# EAGLE design schody.v1 (EAGLE 8.7.0)
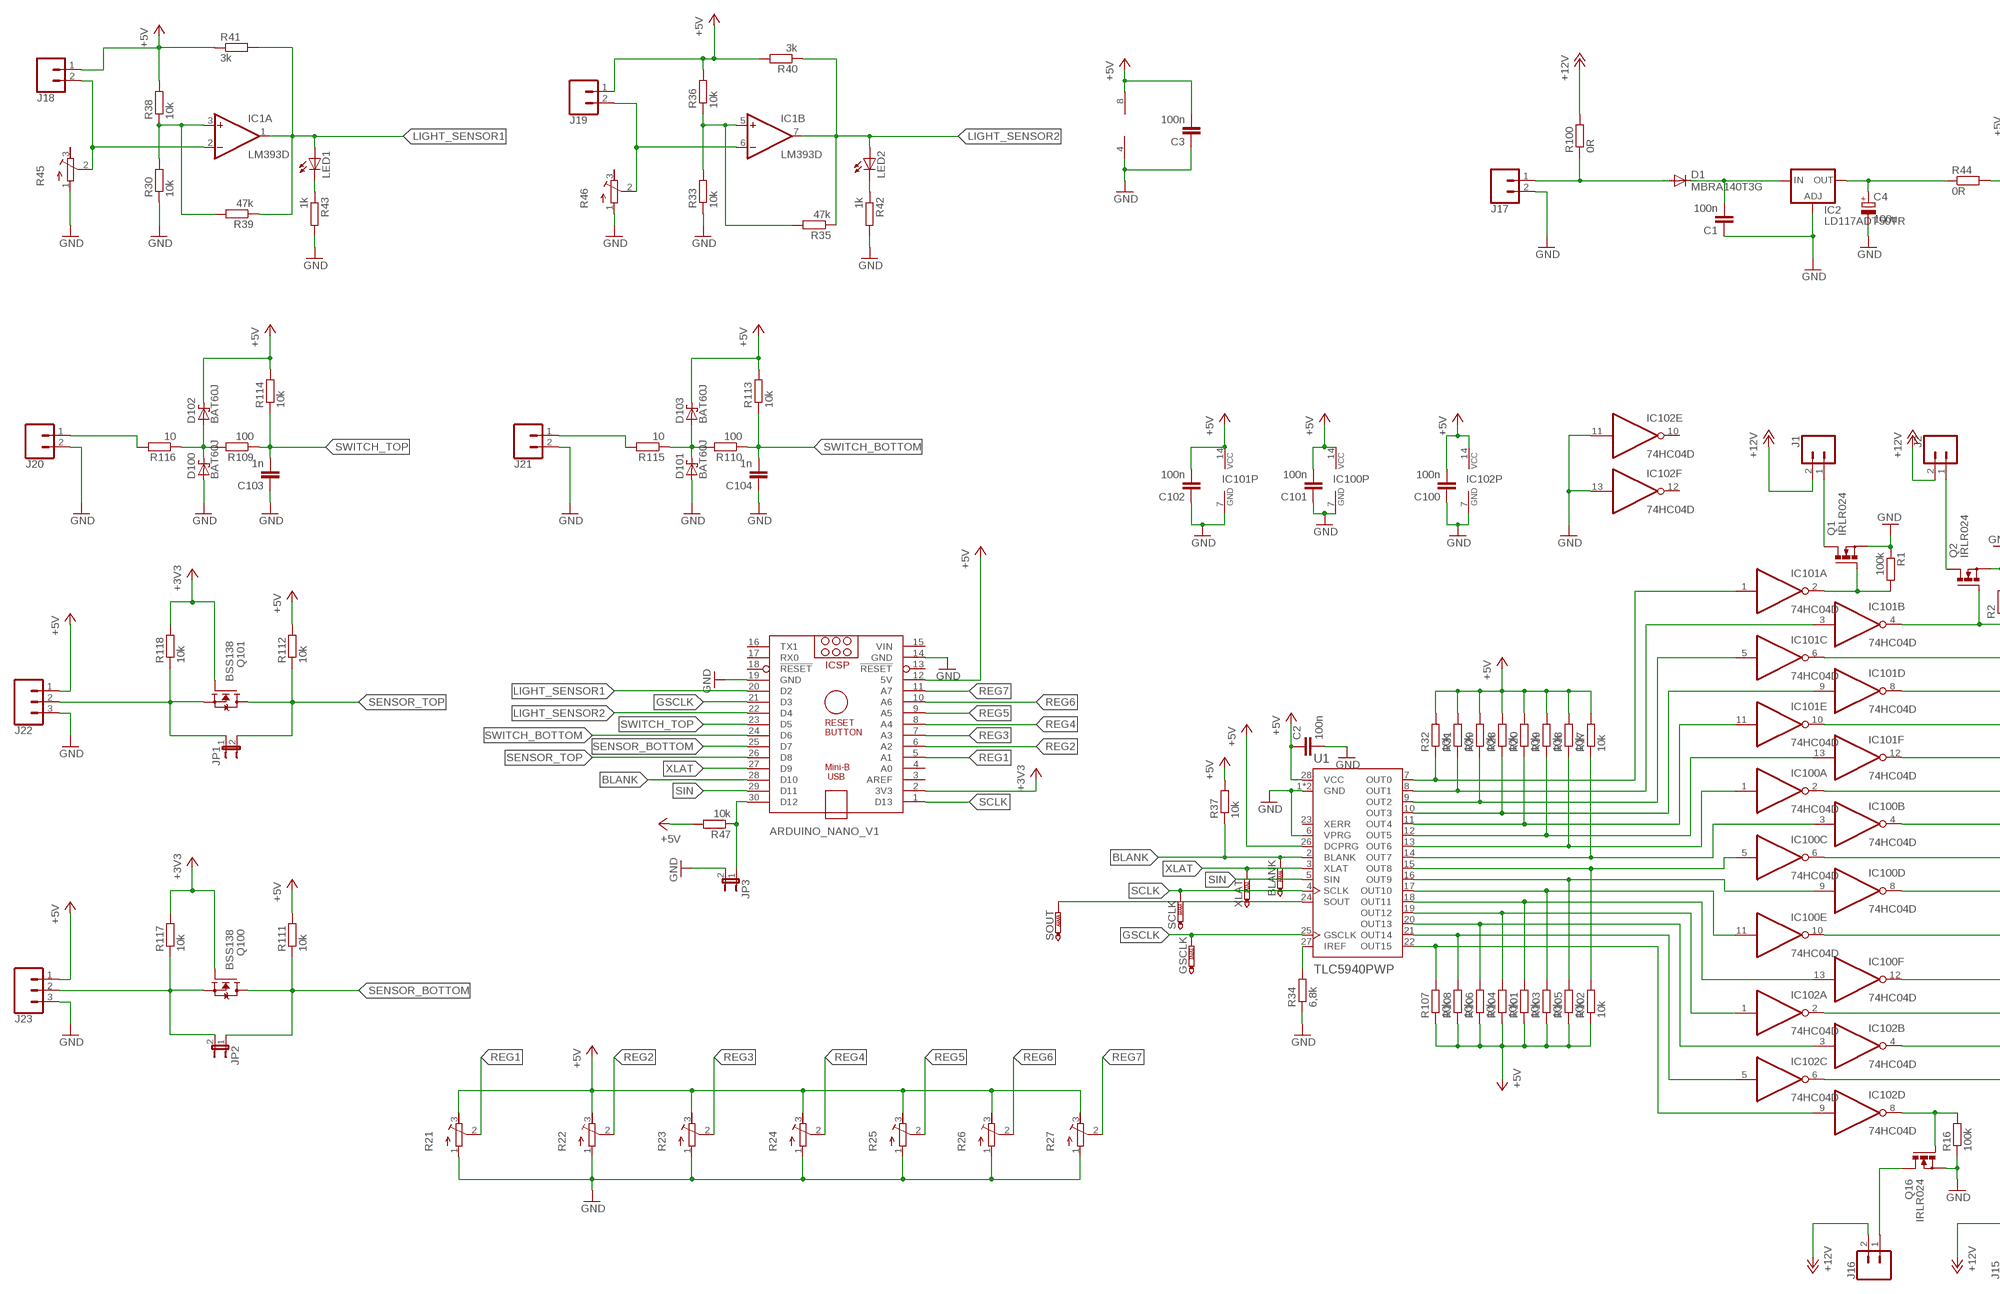
[diagram p0: schematic, sheet 1, part 1 of 2]
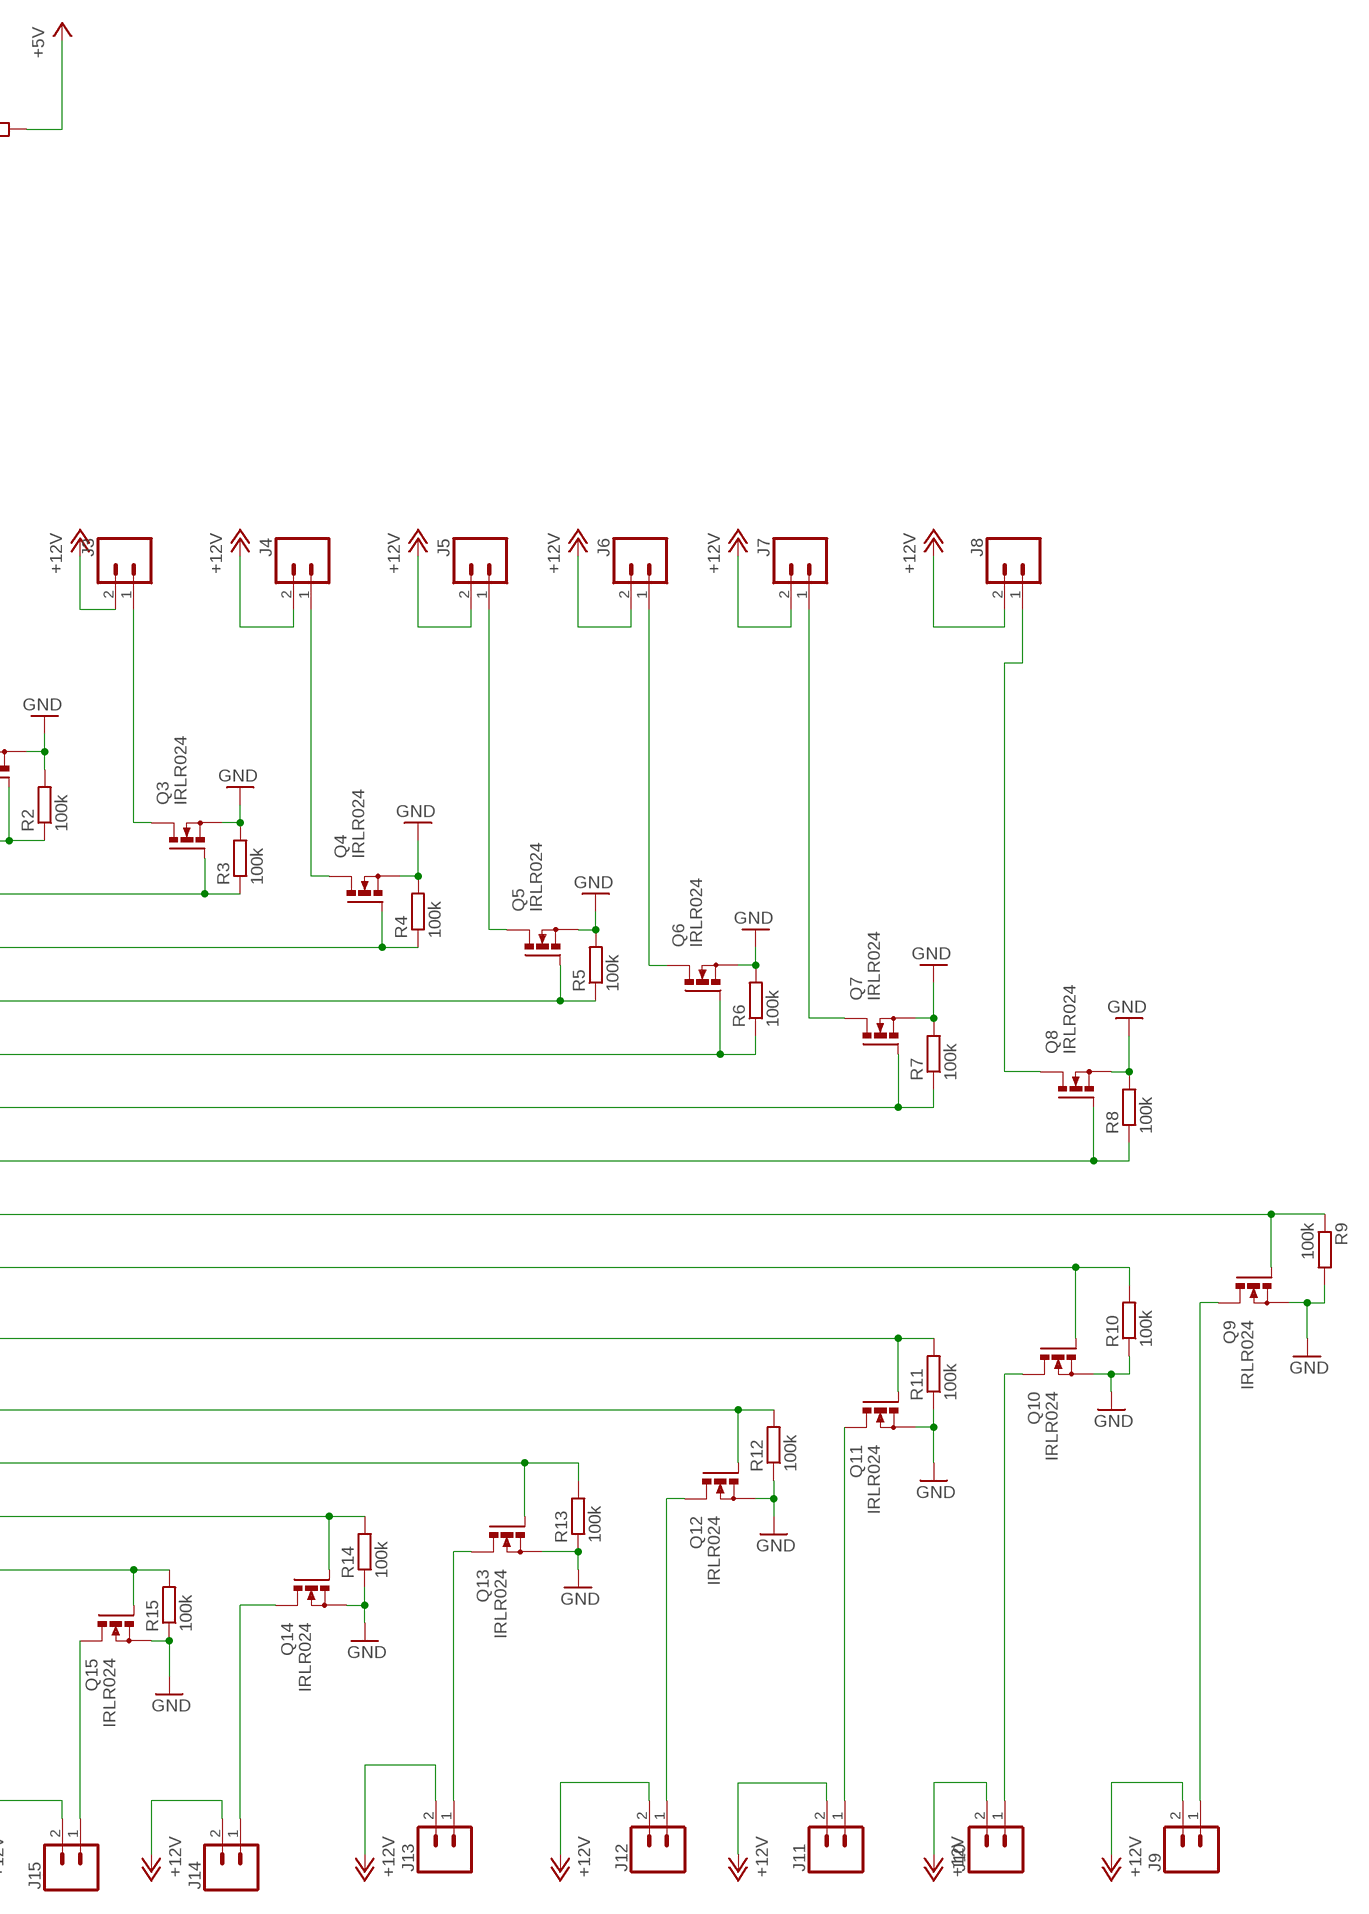
[diagram p1: schematic, sheet 1, part 2 of 2]

## Parts
ARDUINO_NANO_V1  ARDUINO_NANO  [ARDUINO_NANO]
BLANK  PTR1PAD1-13  [P1-13]
C1  100n  C-EUC0805K  [C0805K]
C2  100n  C-EUC0805K  [C0805K]
C3  100n  C-EUC0805K  [C0805K]
C4  100u  CPOL-EUSMCD  [SMC_D]
C100  100n  C-EUC0805K  [C0805K]
C101  100n  C-EUC0805K  [C0805K]
C102  100n  C-EUC0805K  [C0805K]
C103  1n  C-EUC0805K  [C0805K]
C104  1n  C-EUC0805K  [C0805K]
D1  MBRA140T3G  DIODE-DO214BA  [DO214BA]
D100  BAT60J  [SOD323_ST]
D101  BAT60J  [SOD323_ST]
D102  BAT60J  [SOD323_ST]
D103  BAT60J  [SOD323_ST]
GSCLK  PTR1PAD1-13  [P1-13]
IC1  LM393D  [SO08]
IC2  LD117ADT50TR  [DPACK]
IC100  74HC04D  [SO14]
IC101  74HC04D  [SO14]
IC102  74HC04D  [SO14]
J1  CONN_023.5MM  [SCREWTERMINAL-3.5MM-2]
J2  CONN_023.5MM  [SCREWTERMINAL-3.5MM-2]
J3  CONN_023.5MM  [SCREWTERMINAL-3.5MM-2]
J4  CONN_023.5MM  [SCREWTERMINAL-3.5MM-2]
J5  CONN_023.5MM  [SCREWTERMINAL-3.5MM-2]
J6  CONN_023.5MM  [SCREWTERMINAL-3.5MM-2]
J7  CONN_023.5MM  [SCREWTERMINAL-3.5MM-2]
J8  CONN_023.5MM  [SCREWTERMINAL-3.5MM-2]
J9  CONN_023.5MM  [SCREWTERMINAL-3.5MM-2]
J10  CONN_023.5MM  [SCREWTERMINAL-3.5MM-2]
J11  CONN_023.5MM  [SCREWTERMINAL-3.5MM-2]
J12  CONN_023.5MM  [SCREWTERMINAL-3.5MM-2]
J13  CONN_023.5MM  [SCREWTERMINAL-3.5MM-2]
J14  CONN_023.5MM  [SCREWTERMINAL-3.5MM-2]
J15  CONN_023.5MM  [SCREWTERMINAL-3.5MM-2]
J16  CONN_023.5MM  [SCREWTERMINAL-3.5MM-2]
J17  CONN_025MM  [SCREWTERMINAL-5MM-2]
J18  CONN_023.5MM  [SCREWTERMINAL-3.5MM-2]
J19  CONN_023.5MM  [SCREWTERMINAL-3.5MM-2]
J20  CONN_023.5MM  [SCREWTERMINAL-3.5MM-2]
J21  CONN_023.5MM  [SCREWTERMINAL-3.5MM-2]
J22  CONN_03SCREW  [SCREWTERMINAL-3.5MM-3]
J23  CONN_03SCREW  [SCREWTERMINAL-3.5MM-3]
JP1  JP1E  [JP1]
JP2  JP1E  [JP1]
JP3  JP1E  [JP1]
LED1  LEDSML0805  [SML0805]
LED2  LEDSML0805  [SML0805]
Q1  IRLR024  [D-PAK_TO252AA]
Q2  IRLR024  [D-PAK_TO252AA]
Q3  IRLR024  [D-PAK_TO252AA]
Q4  IRLR024  [D-PAK_TO252AA]
Q5  IRLR024  [D-PAK_TO252AA]
Q6  IRLR024  [D-PAK_TO252AA]
Q7  IRLR024  [D-PAK_TO252AA]
Q8  IRLR024  [D-PAK_TO252AA]
Q9  IRLR024  [D-PAK_TO252AA]
Q10  IRLR024  [D-PAK_TO252AA]
Q11  IRLR024  [D-PAK_TO252AA]
Q12  IRLR024  [D-PAK_TO252AA]
Q13  IRLR024  [D-PAK_TO252AA]
Q14  IRLR024  [D-PAK_TO252AA]
Q15  IRLR024  [D-PAK_TO252AA]
Q16  IRLR024  [D-PAK_TO252AA]
Q100  BSS138  [SOT23]
Q101  BSS138  [SOT23]
R1  100k  R-EU_M0805  [M0805]
R2  100k  R-EU_M0805  [M0805]
R3  100k  R-EU_M0805  [M0805]
R4  100k  R-EU_M0805  [M0805]
R5  100k  R-EU_M0805  [M0805]
R6  100k  R-EU_M0805  [M0805]
R7  100k  R-EU_M0805  [M0805]
R8  100k  R-EU_M0805  [M0805]
R9  100k  R-EU_M0805  [M0805]
R10  100k  R-EU_M0805  [M0805]
R11  100k  R-EU_M0805  [M0805]
R12  100k  R-EU_M0805  [M0805]
R13  100k  R-EU_M0805  [M0805]
R14  100k  R-EU_M0805  [M0805]
R15  100k  R-EU_M0805  [M0805]
R16  100k  R-EU_M0805  [M0805]
R17  10k  R-EU_M0805  [M0805]
R18  10k  R-EU_M0805  [M0805]
R19  10k  R-EU_M0805  [M0805]
R20  10k  R-EU_M0805  [M0805]
R21  R-TRIMM64W  [RTRIM64W]
R22  R-TRIMM64W  [RTRIM64W]
R23  R-TRIMM64W  [RTRIM64W]
R24  R-TRIMM64W  [RTRIM64W]
R25  R-TRIMM64W  [RTRIM64W]
R26  R-TRIMM64W  [RTRIM64W]
R27  R-TRIMM64W  [RTRIM64W]
R28  10k  R-EU_M0805  [M0805]
R29  10k  R-EU_M0805  [M0805]
R30  10k  R-EU_M0805  [M0805]
R31  10k  R-EU_M0805  [M0805]
R32  10k  R-EU_M0805  [M0805]
R33  10k  R-EU_M0805  [M0805]
R34  6,8k  R-EU_M0805  [M0805]
R35  47k  R-EU_M0805  [M0805]
R36  10k  R-EU_M0805  [M0805]
R37  10k  R-EU_M0805  [M0805]
R38  10k  R-EU_M0805  [M0805]
R39  47k  R-EU_M0805  [M0805]
R40  3k  R-EU_M0805  [M0805]
R41  3k  R-EU_M0805  [M0805]
R42  1k  R-EU_M0805  [M0805]
R43  1k  R-EU_M0805  [M0805]
R44  0R  R-EU_M1206  [M1206]
R45  R-TRIMM64W  [RTRIM64W]
R46  R-TRIMM64W  [RTRIM64W]
R47  10k  R-EU_M0805  [M0805]
R100  0R  R-EU_R2512  [R2512]
R101  10k  R-EU_M0805  [M0805]
R102  10k  R-EU_M0805  [M0805]
R103  10k  R-EU_M0805  [M0805]
R104  10k  R-EU_M0805  [M0805]
R105  10k  R-EU_M0805  [M0805]
R106  10k  R-EU_M0805  [M0805]
R107  10k  R-EU_M0805  [M0805]
R108  10k  R-EU_M0805  [M0805]
R109  100  R-EU_M0805  [M0805]
R110  100  R-EU_M0805  [M0805]
R111  10k  R-EU_M0805  [M0805]
R112  10k  R-EU_M0805  [M0805]
R113  10k  R-EU_M0805  [M0805]
R114  10k  R-EU_M0805  [M0805]
R115  10  R-EU_M0805  [M0805]
R116  10  R-EU_M0805  [M0805]
R117  10k  R-EU_M0805  [M0805]
R118  10k  R-EU_M0805  [M0805]
SCLK  PTR1PAD1-13  [P1-13]
SOUT  PTR1PAD1-13  [P1-13]
U1  TLC5940PWP  [HTSSOP28PWP]
XLAT  PTR1PAD1-13  [P1-13]

## Nets
+3V3: ARDUINO_NANO_V1.2(3V3) Q100.1(G) Q101.1(G) R117.2 R118.2
+5V: ARDUINO_NANO_V1.12(5V) C2.1 C3.2 C100.2 C101.2 C102.2 D102.C D103.C IC1.8(P:V+) IC100.14(P:VCC) IC101.14(P:VCC) IC102.14(P:VCC) J18.1 J19.1 J22.1 J23.1 R17.2 R18.2 R19.2 R20.2 R21.3(E) R22.3(E) R23.3(E) R24.3(E) R25.3(E) R26.3(E) R27.3(E) R28.2 R29.2 R31.2 R32.2 R36.2 R37.2 R38.2 R40.2 R41.1 R44.2 R47.2 R101.1 R102.1 R103.1 R104.1 R105.1 R106.1 R107.1 R108.1 R111.2 R112.2 R113.2 R114.2 U1.26(DCPRG) U1.28(VCC)
+12V: J1.2 J2.2 J3.2 J4.2 J5.2 J6.2 J7.2 J8.2 J9.2 J10.2 J11.2 J12.2 J13.2 J14.2 J15.2 J16.2 R100.2
BLANK: ARDUINO_NANO_V1.28(D10) BLANK.TP R37.1 U1.2(BLANK)
GND: ARDUINO_NANO_V1.14(GND) ARDUINO_NANO_V1.19(GND) C1.1 C2.2 C3.1 C4.- C100.1 C101.1 C102.1 C103.1 C104.1 D100.A D101.A IC1.4(P:V-) IC2.1(ADJ) IC100.7(P:GND) IC101.7(P:GND) IC102.7(P:GND) IC102.11(E:I) IC102.13(F:I) J17.2 J20.2 J21.2 J22.3 J23.3 JP3.2 Q1.3(SOURCE) Q2.3(SOURCE) Q3.3(SOURCE) Q4.3(SOURCE) Q5.3(SOURCE) Q6.3(SOURCE) Q7.3(SOURCE) Q8.3(SOURCE) Q9.3(SOURCE) Q10.3(SOURCE) Q11.3(SOURCE) Q12.3(SOURCE) Q13.3(SOURCE) Q14.3(SOURCE) Q15.3(SOURCE) Q16.3(SOURCE) R1.1 R2.2 R3.2 R4.2 R5.2 R6.2 R7.2 R8.2 R9.2 R10.1 R11.1 R12.1 R13.1 R14.1 R15.1 R16.1 R21.1(A) R22.1(A) R23.1(A) R24.1(A) R25.1(A) R26.1(A) R27.1(A) R30.1 R33.1 R34.1 R42.2 R43.2 R45.1(A) R46.1(A) U1.1(GND) U1.6(VPRG) U1.EXP(GND)
GSCLK: ARDUINO_NANO_V1.21(D3) GSCLK.TP U1.25(GSCLK)
LIGHT_SENSOR1: ARDUINO_NANO_V1.20(D2) IC1.1(A:OUT) LED1.A R39.1 R41.2
LIGHT_SENSOR2: ARDUINO_NANO_V1.22(D4) IC1.7(B:OUT) LED2.A R35.1 R40.1
N$1: IC101.1(A:I) R32.1 U1.7(OUT0)
N$2: IC101.3(B:I) R31.1 U1.8(OUT1)
N$3: IC101.5(C:I) R29.1 U1.9(OUT2)
N$4: IC101.9(D:I) R28.1 U1.10(OUT3)
N$5: IC101.11(E:I) R20.1 U1.11(OUT4)
N$6: IC101.13(F:I) R19.1 U1.12(OUT5)
N$7: IC100.1(A:I) R18.1 U1.13(OUT6)
N$8: IC100.3(B:I) R17.1 U1.14(OUT7)
N$9: IC102.9(D:I) R107.2 U1.22(OUT15)
N$10: IC101.2(A:O) Q1.1(GATE) R1.2
N$11: IC102.3(B:I) R106.2 U1.20(OUT13)
N$12: IC102.1(A:I) R104.2 U1.19(OUT12)
N$13: IC100.13(F:I) R101.2 U1.18(OUT11)
N$14: IC100.11(E:I) R103.2 U1.17(OUT10)
N$15: IC100.9(D:I) R105.2 U1.16(OUT9)
N$16: IC100.5(C:I) R102.2 U1.15(OUT8)
N$17: IC102.5(C:I) R108.2 U1.21(OUT14)
N$18: J2.1 Q2.2(DRAIN)
N$19: IC101.6(C:O) Q3.1(GATE) R3.1
N$20: J4.1 Q4.2(DRAIN)
N$21: IC100.4(B:O) Q8.1(GATE) R8.1
N$22: J3.1 Q3.2(DRAIN)
N$23: IC101.8(D:O) Q4.1(GATE) R4.1
N$24: IC102.8(D:O) Q16.1(GATE) R16.2
N$25: J16.1 Q16.2(DRAIN)
N$26: J1.1 Q1.2(DRAIN)
N$27: IC101.10(E:O) Q5.1(GATE) R5.1
N$28: J5.1 Q5.2(DRAIN)
N$29: J8.1 Q8.2(DRAIN)
N$30: IC101.12(F:O) Q6.1(GATE) R6.1
N$31: J10.1 Q10.2(DRAIN)
N$32: J6.1 Q6.2(DRAIN)
N$33: IC102.6(C:O) Q15.1(GATE) R15.2
N$34: J15.1 Q15.2(DRAIN)
N$35: SOUT.TP U1.24(SOUT)
N$36: IC102.4(B:O) Q14.1(GATE) R14.2
N$37: J14.1 Q14.2(DRAIN)
N$38: IC100.8(D:O) Q10.1(GATE) R10.2
N$39: IC102.2(A:O) Q13.1(GATE) R13.2
N$40: IC100.6(C:O) Q9.1(GATE) R9.1
N$41: J13.1 Q13.2(DRAIN)
N$42: J20.1 R116.2
N$43: IC100.12(F:O) Q12.1(GATE) R12.2
N$44: J12.1 Q12.2(DRAIN)
N$45: J9.1 Q9.2(DRAIN)
N$46: IC100.10(E:O) Q11.1(GATE) R11.2
N$47: J11.1 Q11.2(DRAIN)
N$48: J21.1 R115.2
N$49: IC1.3(A:+IN) R30.2 R38.1 R39.2
N$50: IC1.2(A:-IN) J18.2 R45.2(S)
N$51: C1.2 D1.C IC2.3(IN)
N$52: D1.A J17.1 R100.1
N$53: IC1.6(B:-IN) J19.2 R46.2(S)
N$54: IC1.5(B:+IN) R33.2 R35.2 R36.1
N$55: R34.2 U1.27(IREF)
N$57: D101.C D103.A R110.2 R115.1
N$59: D100.C D102.A R109.2 R116.1
N$62: ARDUINO_NANO_V1.30(D12) JP3.1 R47.1
N$63: J22.2 JP1.1 Q101.2(S) R118.1
N$64: J23.2 JP2.2 Q100.2(S) R117.1
N$66: C4.+ IC2.4(OUT) R44.1
N$67: LED1.C R43.1
N$69: LED2.C R42.1
N$70: IC101.4(B:O) Q2.1(GATE) R2.1
N$71: IC100.2(A:O) Q7.1(GATE) R7.1
N$73: J7.1 Q7.2(DRAIN)
REG1: ARDUINO_NANO_V1.5(A1) R21.2(S)
REG2: ARDUINO_NANO_V1.6(A2) R22.2(S)
REG3: ARDUINO_NANO_V1.7(A3) R23.2(S)
REG4: ARDUINO_NANO_V1.8(A4) R24.2(S)
REG5: ARDUINO_NANO_V1.9(A5) R25.2(S)
REG6: ARDUINO_NANO_V1.10(A6) R26.2(S)
REG7: ARDUINO_NANO_V1.11(A7) R27.2(S)
SCLK: ARDUINO_NANO_V1.1(D13) SCLK.TP U1.4(SCLK)
SENSOR_BOTTOM: ARDUINO_NANO_V1.25(D7) JP2.1 Q100.3(D) R111.1
SENSOR_TOP: ARDUINO_NANO_V1.26(D8) JP1.2 Q101.3(D) R112.1
SIN: ARDUINO_NANO_V1.29(D11) U1.5(SIN)
SWITCH_BOTTOM: ARDUINO_NANO_V1.24(D6) C104.2 R110.1 R113.1
SWITCH_TOP: ARDUINO_NANO_V1.23(D5) C103.2 R109.1 R114.1
XLAT: ARDUINO_NANO_V1.27(D9) U1.3(XLAT) XLAT.TP
Unconnected: ARDUINO_NANO_V1.3(AREF) ARDUINO_NANO_V1.4(A0) ARDUINO_NANO_V1.13(!RESET) ARDUINO_NANO_V1.16(TX1) ARDUINO_NANO_V1.17(RX0) ARDUINO_NANO_V1.18(!RESET) IC102.10(E:O) IC102.12(F:O) R45.3(E) R46.3(E) U1.23(XERR)

## Power pins joined to a net without a drawn wire
VIN: ARDUINO_NANO_V1.15(VIN)

## Library data of the parts
ARDUINO_NANO_V1 = ArduinoNanoV30:ARDUINO_NANO: Arduino Nano V3.0 Overview: The Arduino Nano is a small, complete, and breadboard-friendly board based on the ATmega328 (Arduino Nano 3.x) or ATmega168 (Arduino Nano 2.x). It has more or less the same functionality of the Arduino Duemilanove, but in a different package. It lacks only a DC power jack, and works with a Mini-B USB cable instead of a standard one. The Nano was designed and is being produced by Gravitech. Specifications: Microcontroller Atmel ATmega168 or ATmega328 Operating Voltage (logic level) 5 V Input Voltage (recommended) 7-12 V Input Voltage (limits) 6-20 V Digital I/O Pins 14 (of which 6 provide PWM output) Analog Input Pins 8 DC Current per I/O Pin 40 mA Flash Memory 16 KB (ATmega168) or 32 KB (ATmega328) of which 2 KB used by bootloader SRAM 1 KB (ATmega168) or 2 KB (ATmega328) EEPROM 512 bytes (ATmega168) or 1 KB (ATmega328) Clock Speed 16 MHz Dimensions 0.73" x 1.70" Length 45 mm Width 18 mm Weigth 5 g Power: The Arduino Nano can be powered via the Mini-B USB connection, 6-20V unregulated external power supply (pin 30), or 5V regulated external power supply (pin 27). The power source is automatically selected to the highest voltage source. Memory: The ATmega168 has 16 KB of flash memory for storing code (of which 2 KB is used for the bootloader); the ATmega328 has 32 KB, (also with 2 KB used for the bootloader). The ATmega168 has 1 KB of SRAM and 512 bytes of EEPROM (which can be read and written with the EEPROM library); the ATmega328 has 2 KB of SRAM and 1 KB of EEPROM. Input and Output: Each of the 14 digital pins on the Nano can be used as an input or output, using pinMode(), digitalWrite(), and digitalRead() functions. They operate at 5 volts. Each pin can provide or receive a maximum of 40 mA and has an internal pull-up resistor (disconnected by default) of 20-50 kOhms. In addition, some pins have specialized functions. Visit Arduino - ArduinoBoardNano <https://www.arduino.cc/en/Main/ArduinoBoardNano>
BLANK GSCLK SCLK SOUT XLAT = testpad:PTR1: TEST PIN
C1-C3 C100-C104 = rcl:C-EU: CAPACITOR, European symbol; SPICEPREFIX: C
C4 = rcl:CPOL-EU: POLARIZED CAPACITOR, European symbol; SPICEPREFIX: C
D1 = diode:DIODE-: DIODE
D100-D103 = diode:BAT60J: Schottky barrier diode Source: www.st.com, BAT60J.pdf
IC1 = linear:LM393: COMPARATOR
IC2 = v-reg:LD117A?*: Low drop fixed and adjustable positive voltage regulators 1 A Source: http://www.st.com/stonline/products/literature/ds/7194/ld1117axx.pdf
IC100-IC102 = 74xx-eu:74*04: Hex INVERTER
J1-J16 J18-J21 = SparkFun-Connectors:CONN_02: Multi connection point. Often used as Generic Header-pin footprint for 0.1 inch spaced/style header connections On any of the 0.1 inch spaced packages, you can populate with these: Break Away Headers - Straight <https://www.sparkfun.com/products/116> (PRT-00116) Break Away Male Headers - Right Angle <https://www.sparkfun.com/products/553> (PRT-00553) Female Headers <https://www.sparkfun.com/products/115> (PRT-00115) Break Away Headers - Machine Pin <https://www.sparkfun.com/products/117> (PRT-00117) Break Away Female Headers - Swiss Machine Pin <https://www.sparkfun.com/products/743> (PRT-00743) For SCREWTERMINALS and SPRING TERMINALS visit here: Screw Terimnals on SparkFun.com <https://www.sparkfun.com/search/results?term=Screw+Terminals> (5mm/3.5mm/2.54mm spacing) This device is also useful as a general connection point to wire up your design to another part of your project. Our various solder wires solder well into these plated through hole pads. Hook-Up Wire - Assortment (Stranded, 22 AWG) <https://www.sparkfun.com/products/11375> (PRT-11375) Hook-Up Wire - Assortment (Solid Core, 22 AWG) <https://www.sparkfun.com/products/11367> (PRT-11367) View the entire wire category on our website here <https://www.sparkfun.com/categories/141> Special notes: Molex polarized connector foot print use with: PRT-08233 with associated crimp pins and housings. 2.54_SCREWTERM for use with PRT-10571. 3.5mm Screw Terminal footprints for PRT-08084 5mm Screw Terminal footprints for use with PRT-08432; PROD_ID: CONN-08399
J17 = SparkFun-Connectors:CONN_02: Multi connection point. Often used as Generic Header-pin footprint for 0.1 inch spaced/style header connections On any of the 0.1 inch spaced packages, you can populate with these: Break Away Headers - Straight <https://www.sparkfun.com/products/116> (PRT-00116) Break Away Male Headers - Right Angle <https://www.sparkfun.com/products/553> (PRT-00553) Female Headers <https://www.sparkfun.com/products/115> (PRT-00115) Break Away Headers - Machine Pin <https://www.sparkfun.com/products/117> (PRT-00117) Break Away Female Headers - Swiss Machine Pin <https://www.sparkfun.com/products/743> (PRT-00743) For SCREWTERMINALS and SPRING TERMINALS visit here: Screw Terimnals on SparkFun.com <https://www.sparkfun.com/search/results?term=Screw+Terminals> (5mm/3.5mm/2.54mm spacing) This device is also useful as a general connection point to wire up your design to another part of your project. Our various solder wires solder well into these plated through hole pads. Hook-Up Wire - Assortment (Stranded, 22 AWG) <https://www.sparkfun.com/products/11375> (PRT-11375) Hook-Up Wire - Assortment (Solid Core, 22 AWG) <https://www.sparkfun.com/products/11367> (PRT-11367) View the entire wire category on our website here <https://www.sparkfun.com/categories/141> Special notes: Molex polarized connector foot print use with: PRT-08233 with associated crimp pins and housings. 2.54_SCREWTERM for use with PRT-10571. 3.5mm Screw Terminal footprints for PRT-08084 5mm Screw Terminal footprints for use with PRT-08432; SF_SKU: PRT-08432
J22 J23 = SparkFun-Connectors:CONN_03: Multi connection point. Often used as Generic Header-pin footprint for 0.1 inch spaced/style header connections On any of the 0.1 inch spaced packages, you can populate with these: Break Away Headers - Straight <https://www.sparkfun.com/products/116> (PRT-00116) Break Away Male Headers - Right Angle <https://www.sparkfun.com/products/553> (PRT-00553) Female Headers <https://www.sparkfun.com/products/115> (PRT-00115) Break Away Headers - Machine Pin <https://www.sparkfun.com/products/117> (PRT-00117) Break Away Female Headers - Swiss Machine Pin <https://www.sparkfun.com/products/743> (PRT-00743) Stackable Header - 3 Pin (Female, 0.1") <https://www.sparkfun.com/products/13875> (PRT-13875) For SCREWTERMINALS and SPRING TERMINALS visit here: Screw Terimnals on SparkFun.com <https://www.sparkfun.com/search/results?term=Screw+Terminals> (5mm/3.5mm/2.54mm spacing) This device is also useful as a general connection point to wire up your design to another part of your project. Our various solder wires solder well into these plated through hole pads. Hook-Up Wire - Assortment (Stranded, 22 AWG) <https://www.sparkfun.com/products/11375> (PRT-11375) Hook-Up Wire - Assortment (Solid Core, 22 AWG) <https://www.sparkfun.com/products/11367> (PRT-11367) View the entire wire category on our website here <https://www.sparkfun.com/categories/141> Special notes: Molex polarized connector foot print use with SKU : PRT-08232 with associated crimp pins and housings.; PROD_ID: CONN-08288; SF_ID: PRT-08235
JP1-JP3 = jumper:JP1E: JUMPER
LED1 LED2 = led:LED: LED OSRAM: - CHIPLED LG R971, LG N971, LY N971, LG Q971, LY Q971, LO R971, LY R971 LH N974, LH R974 LS Q976, LO Q976, LY Q976 LO Q996 - Hyper CHIPLED LW Q18S LB Q993, LB Q99A, LB R99A - SideLED LS A670, LO A670, LY A670, LG A670, LP A670 LB A673, LV A673, LT A673, LW A673 LH A674 LY A675 LS A676, LA A676, LO A676, LY A676, LW A676 LS A679, LY A679, LG A679 - Hyper Micro SIDELED® LS Y876, LA Y876, LO Y876, LY Y876 LT Y87S - SmartLED LW L88C, LW L88S LB L89C, LB L89S, LG L890 LS L89K, LO L89K, LY L89K LS L896, LA L896, LO L896, LY L896 - TOPLED LS T670, LO T670, LY T670, LG T670, LP T670 LSG T670, LSP T670, LSY T670, LOP T670, LYG T670 LG T671, LOG T671, LSG T671 LB T673, LV T673, LT T673, LW T673 LH T674 LS T676, LA T676, LO T676, LY T676, LB T676, LH T676, LSB T676, LW T676 LB T67C, LV T67C, LT T67C, LS T67K, LO T67K, LY T67K, LW E67C LS E67B, LA E67B, LO E67B, LY E67B, LB E67C, LV E67C, LT E67C LW T67C LS T679, LY T679, LG T679 LS T770, LO T770, LY T770, LG T770, LP T770 LB T773, LV T773, LT T773, LW T773 LH T774 LS E675, LA E675, LY E675, LS T675 LS T776, LA T776, LO T776, LY T776, LB T776 LHGB T686 LT T68C, LB T68C - Hyper Mini TOPLED® LB M676 - Mini TOPLED Santana® LG M470 LS M47K, LO M47K, LY M47K Source: http://www.osram.convergy.de LUXEON: - LUMILED® LXK2-PW12-R00, LXK2-PW12-S00, LXK2-PW14-U00, LXK2-PW14-V00 LXK2-PM12-R00, LXK2-PM12-S00, LXK2-PM14-U00 LXK2-PE12-Q00, LXK2-PE12-R00, LXK2-PE12-S00, LXK2-PE14-T00, LXK2-PE14-U00 LXK2-PB12-K00, LXK2-PB12-L00, LXK2-PB12-M00, LXK2-PB14-N00, LXK2-PB14-P00, LXK2-PB14-Q00 LXK2-PR12-L00, LXK2-PR12-M00, LXK2-PR14-Q00, LXK2-PR14-R00 LXK2-PD12-Q00, LXK2-PD12-R00, LXK2-PD12-S00 LXK2-PH12-R00, LXK2-PH12-S00 LXK2-PL12-P00, LXK2-PL12-Q00, LXK2-PL12-R00 Source: www.luxeon.com KINGBRIGHT: KA-3528ASYC Source: www.kingbright.com
Q1-Q16 = IRLR024:IRLR024
Q100 Q101 = bss138_10:BSS138: BSS138 N-Channel Logic Level Enhancement Mode Field Effect Transistor Source: http://www.fairchildsemi.com/datasheets/BS/BSS138.pdf; MF: Fairchild; MPN: BSS138; OC_FARNELL: 9845330; OC_NEWARK: 67R2009
R1-R20 R28-R43 R47 R100-R118 = resistor:R-EU_: RESISTOR, European symbol
R21-R27 R45 R46 = resistor:R-TRIMM: Trimm resistor
R44 = rcl:R-EU_: RESISTOR, European symbol; SPICEPREFIX: R
U1 = tlc5940a:TLC5940

## Board
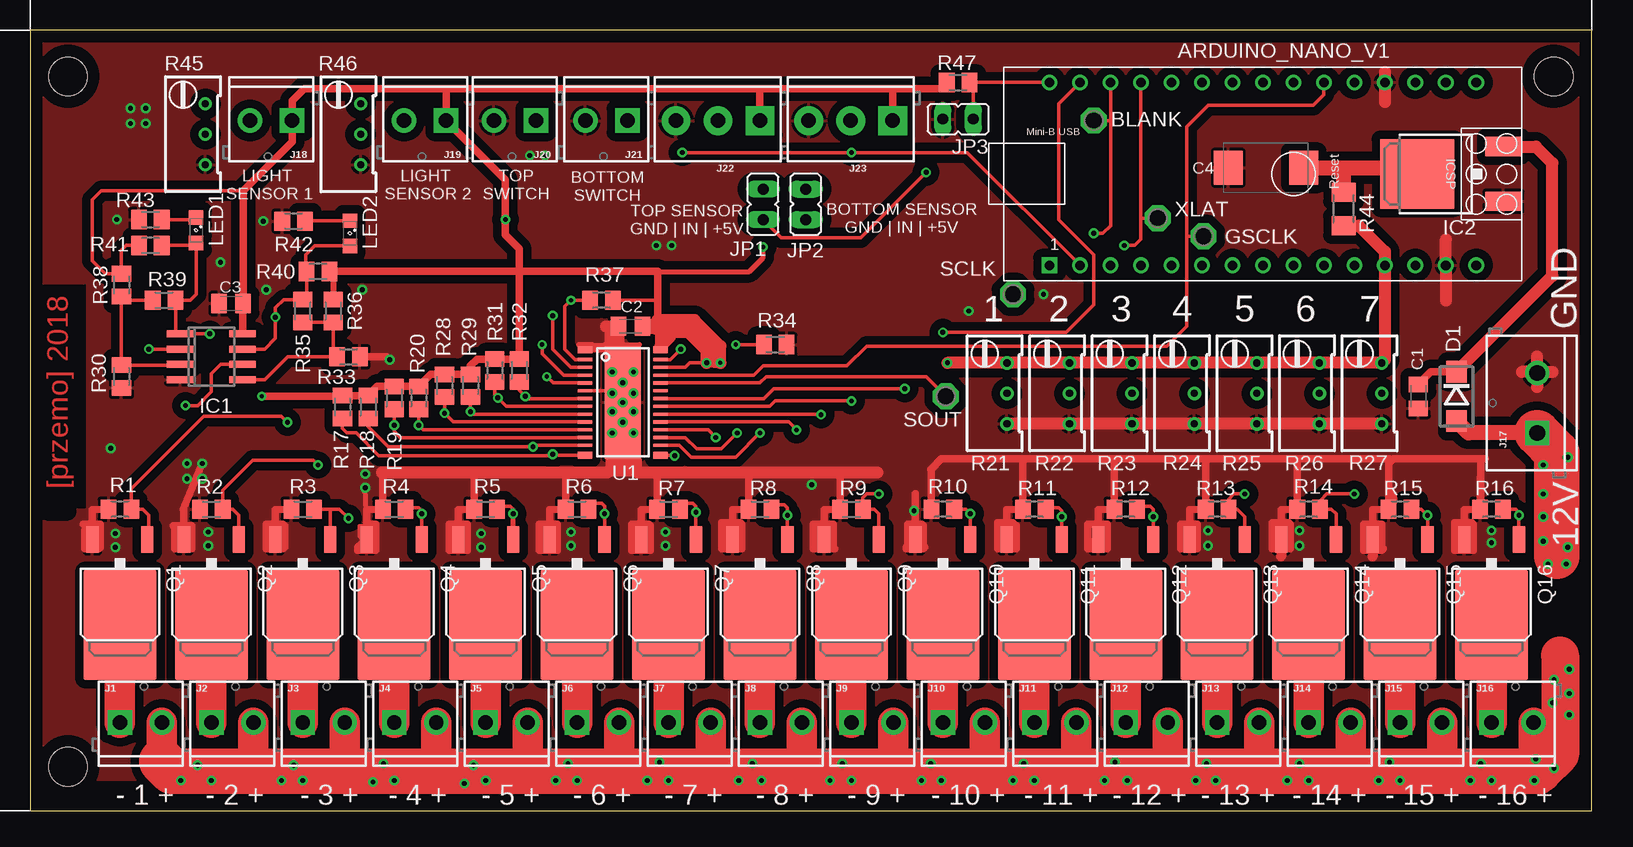
[diagram p2: board, top side]
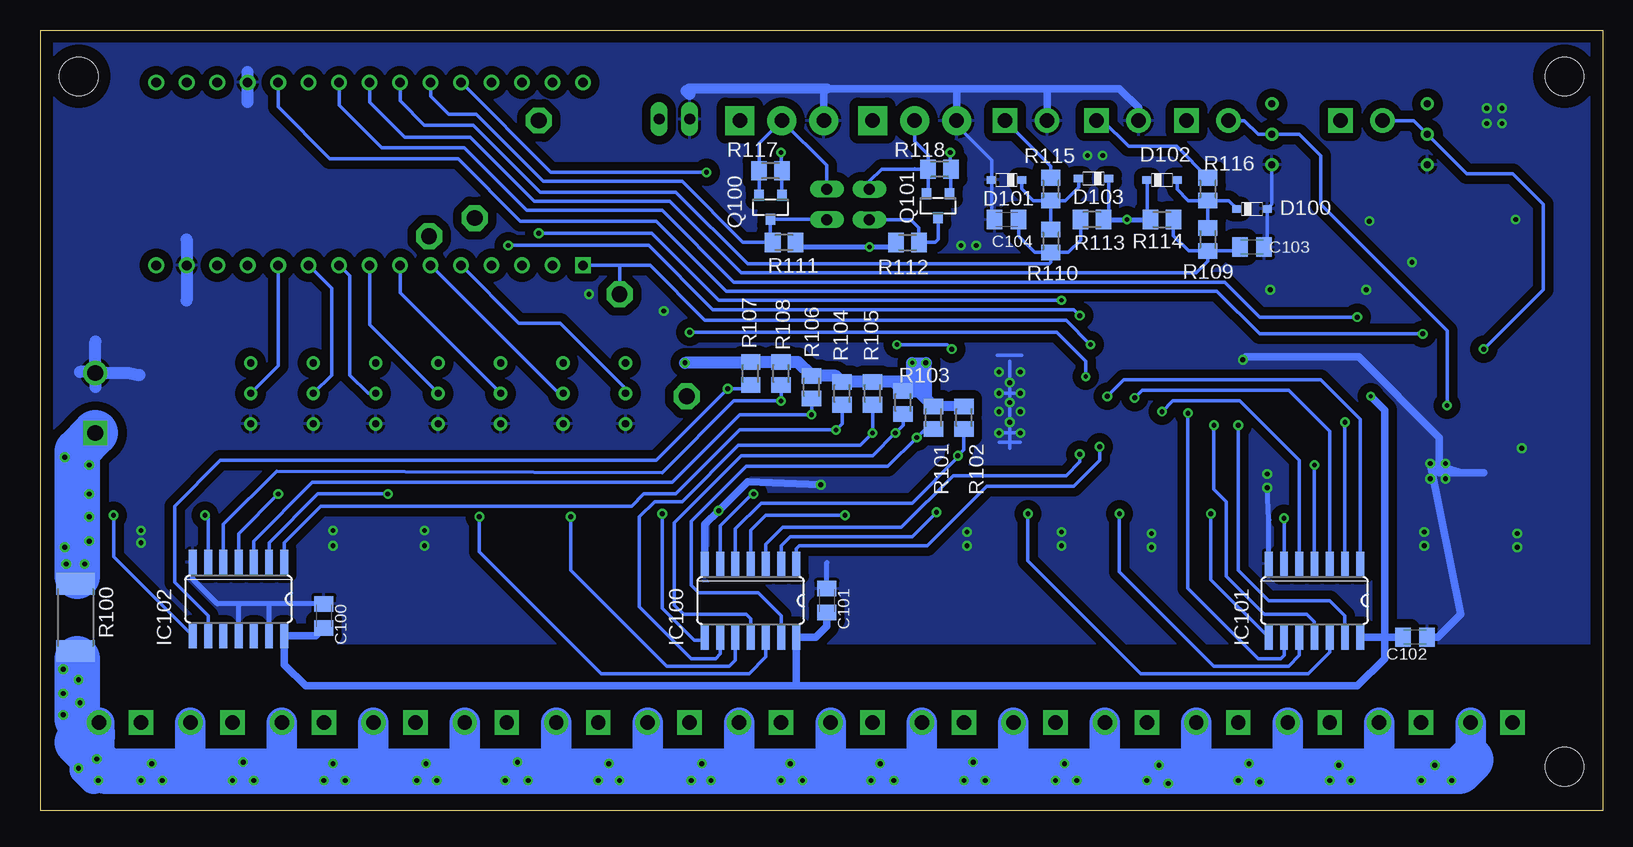
[diagram p3: board, bottom side, seen from below]

Size 130.16 x 65.08 mm. Coordinates in mm from the lower left corner, seen from the top.
Outline: 0,0 130.16,0 130.16,65.08 0,65.08 0,0
Copper layers (1*16): Top 0.035mm / dielectric 1.5mm / Bottom 0.035mm
Design rules "default *": minimum track width 3mil, minimum drill 0.35mm, track to track 6mil, track to pad 6mil, pad to pad 6mil, via to via 6mil, smd to smd 6mil, copper to edge 40mil, drill to drill 6mil, minimum pad ring 10mil, minimum via ring 8mil, stop-mask expansion 4mil, vias tented up to drill 0mil, thermal gap 10mil
Holes 3.2 mm at 3.17,3.68 3.17,61.21 126.98,61.21

### Footprints (pad centres in the part's own frame; a part is rotated, then mirrored left to right if it is on the bottom)
ARDUINO_NANO = drill 0.8 square: 1 -20.32,-7.62 | drill 0.8: 2 -17.78,-7.62; 3 -15.24,-7.62; 4 -12.7,-7.62; 5 -10.16,-7.62; 6 -7.62,-7.62; 7 -5.08,-7.62; 8 -2.54,-7.62; 9 0,-7.62; 10 2.54,-7.62; 11 5.08,-7.62; 12 7.62,-7.62; 13 10.16,-7.62; 14 12.7,-7.62; 15 15.24,-7.62; 16 15.24,7.62; 17 12.7,7.62; 18 10.16,7.62; 19 7.62,7.62; 20 5.08,7.62; 21 2.54,7.62; 22 0,7.62; 23 -2.54,7.62; 24 -5.08,7.62; 25 -7.62,7.62; 26 -10.16,7.62; 27 -12.7,7.62; 28 -15.24,7.62; 29 -17.78,7.62; 30 -20.32,7.62
P1-13 = drill 1.321 pad 2.159 octagon: TP 0,0
C0805K = smd 1.3 x 1.6: 1 -1,0; 2 1,0
SMC_D = smd 2.4 x 2.8: + -3.15,0; - 3.15,0
DO214BA = smd 1.8 x 1.7: A 2.05,0; C -2.05,0
SOD323_ST = smd 0.8 x 0.6: A 1.25,0; C -1.25,0
SO08 = smd 0.6 x 2.2: 1 -1.905,-2.6; 2 -0.635,-2.6; 3 0.635,-2.6; 4 1.905,-2.6; 5 1.905,2.6; 6 0.635,2.6; 7 -0.635,2.6; 8 -1.905,2.6
DPACK = smd 1.6 x 3: 1 -2.28,-4.8; 3 2.28,-4.8 | smd 5.8 x 6.2: 4 0,2.38
SO14 = smd 0.66 x 2.032: 1 -3.81,-3.073; 2 -2.54,-3.073; 3 -1.27,-3.073; 4 0,-3.073; 5 1.27,-3.073; 6 2.54,-3.073; 7 3.81,-3.073; 8 3.81,3.073; 9 2.54,3.073; 10 1.27,3.073; 11 0,3.073; 12 -1.27,3.073; 13 -2.54,3.073; 14 -3.81,3.073
SCREWTERMINAL-3.5MM-2 = drill 1.2 pad 2.032 square: 1 0,0 | drill 1.2 pad 2.032: 2 3.5,0
SCREWTERMINAL-5MM-2 = drill 1.3 pad 2.032 square: 1 0,0 | drill 1.3 pad 2.032: 2 5,0
SCREWTERMINAL-3.5MM-3 = drill 1.2 pad 2.413 square: 1 0,0 | drill 1.2 pad 2.413: 2 3.5,0; 3 7,0
JP1 = drill 0.914 long: 1 0,-1.27; 2 0,1.27
SML0805 = smd 1.2 x 1.2: A 1.05,0; C -1.05,0
D-PAK_TO252AA = smd 1.067 x 2.184: 1 -2.286,-4.572; 3 2.286,-4.572 | smd 6.096 x 9.144: 2 0,2.54
SOT23 = smd 0.8 x 0.9: 1 -0.95,-1; 2 0.95,-1; 3 0,1
M0805 = smd 1.3 x 1.6: 1 -0.95,0; 2 0.95,0
RTRIM64W = drill 0.61: 1 1.27,-2.54; 2 1.27,0; 3 1.27,2.54
M1206 = smd 1.6 x 2: 1 -1.4,0; 2 1.4,0
R2512 = smd 1.8 x 3.2: 1 -2.8,0; 2 2.8,0
HTSSOP28PWP = smd 0.61 x 1.2: 1 -4.395,-3.154; 14 4.395,-3.154; 15 4.395,3.154; 28 -4.395,3.154 | smd 0.27 x 1.2: 2 -3.575,-3.154; 3 -2.925,-3.154; 4 -2.275,-3.154; 5 -1.625,-3.154; 6 -0.975,-3.154; 7 -0.325,-3.154; 8 0.325,-3.154; 9 0.975,-3.154; 10 1.625,-3.154; 11 2.275,-3.154; 12 2.925,-3.154; 13 3.575,-3.154; 16 3.575,3.154; 17 2.925,3.154; 18 2.275,3.154; 19 1.625,3.154; 20 0.975,3.154; 21 0.325,3.154; 22 -0.325,3.154; 23 -0.975,3.154; 24 -1.625,3.154; 25 -2.275,3.154; 26 -2.925,3.154; 27 -3.575,3.154 | smd 9.4 x 3: EXP 0,0

### Placement (x,y rotation side)
ARDUINO_NANO_V1  105.28,53.09 0 top
BLANK  88.65,57.53 0 top
C1  115.7,34.54 90 top
C2  50.04,40.39 180 top
C3  16.76,42.29 0 top
C4  103,53.59 180 top
C100  106.55,16.26 270 bottom
C101  64.64,17.53 270 bottom
C102  15.62,14.48 180 bottom
C103  29.21,46.99 180 bottom
C104  49.66,49.28 0 bottom
D1  118.87,34.54 270 top
D100  29.21,50.16 0 bottom
D101  49.66,52.58 180 bottom
D102  36.7,52.58 0 bottom
D103  42.42,52.7 180 bottom
GSCLK  97.79,47.88 0 top
IC1  15.11,37.85 270 top
IC2  117.98,53.09 90 top
IC100  70.99,17.53 180 bottom
IC101  24,17.53 180 bottom
IC102  113.67,17.65 180 bottom
J1  7.49,7.37 0 top
J2  15.11,7.37 0 top
J3  22.73,7.37 0 top
J4  30.35,7.37 0 top
J5  37.97,7.37 0 top
J6  45.59,7.37 0 top
J7  53.21,7.37 0 top
J8  60.83,7.37 0 top
J9  68.45,7.37 0 top
J10  76.07,7.37 0 top
J11  83.69,7.37 0 top
J12  91.31,7.37 0 top
J13  98.93,7.37 0 top
J14  106.55,7.37 0 top
J15  114.17,7.37 0 top
J16  121.79,7.37 0 top
J17  125.6,31.5 90 top
J18  21.84,57.53 180 top
J19  34.67,57.53 180 top
J20  42.16,57.53 180 top
J21  49.78,57.53 180 top
J22  60.83,57.53 180 top
J23  71.88,57.53 180 top
JP1  61.09,50.55 180 top
JP2  64.64,50.55 0 top
JP3  77.34,57.66 90 top
LED1  13.84,48.39 270 top
LED2  26.67,48.13 270 top
Q1  7.49,18.03 180 top
Q2  15.11,18.03 180 top
Q3  22.73,18.03 180 top
Q4  30.35,18.03 180 top
Q5  37.97,18.03 180 top
Q6  45.59,18.03 180 top
Q7  53.21,18.03 180 top
Q8  60.83,18.03 180 top
Q9  68.45,18.03 180 top
Q10  76.07,18.03 180 top
Q11  83.69,18.03 180 top
Q12  91.31,18.03 180 top
Q13  98.93,18.03 180 top
Q14  106.55,18.03 180 top
Q15  114.17,18.03 180 top
Q16  121.79,18.03 180 top
Q100  69.34,50.29 180 bottom
Q101  55.37,50.42 180 bottom
R1  7.49,25.15 0 top
R2  15.11,25.15 180 top
R3  22.73,25.15 180 top
R4  30.35,25.15 180 top
R5  37.97,25.15 180 top
R6  45.59,25.15 180 top
R7  53.21,25.15 180 top
R8  60.83,25.15 180 top
R9  68.45,25.15 180 top
R10  76.07,25.15 0 top
R11  83.69,25.15 0 top
R12  91.31,25.15 0 top
R13  98.93,25.15 0 top
R14  106.55,25.15 0 top
R15  114.17,25.15 0 top
R16  121.79,25.15 0 top
R17  26.04,33.66 90 top
R18  28.19,33.66 90 top
R19  30.35,34.42 90 top
R20  32.38,34.42 90 top
R21  80.14,34.8 0 top
R22  85.34,34.8 0 top
R23  90.55,34.8 0 top
R24  95.76,34.8 0 top
R25  100.97,34.8 0 top
R26  106.17,34.8 0 top
R27  111.38,34.8 0 top
R28  34.54,35.43 90 top
R29  36.7,35.43 90 top
R30  7.62,36.2 90 top
R31  38.73,36.7 90 top
R32  40.77,36.7 90 top
R33  26.54,37.85 180 top
R34  62.1,38.86 180 top
R35  22.73,41.66 270 top
R36  25.27,41.66 90 top
R37  47.62,42.55 0 top
R38  7.62,43.81 90 top
R39  11.18,42.55 180 top
R40  24,44.96 0 top
R41  10.03,47.12 0 top
R42  21.97,49.15 180 top
R43  10.03,49.28 180 top
R44  109.47,50.16 270 top
R45  13.34,56.39 0 top
R46  26.29,56.39 0 top
R47  77.34,60.71 180 top
R100  127.25,16.13 270 bottom
R101  55.75,32.77 270 bottom
R102  53.21,32.77 270 bottom
R103  58.29,34.04 270 bottom
R104  63.37,34.8 270 bottom
R105  60.83,34.8 270 bottom
R106  65.91,35.31 270 bottom
R107  70.99,36.45 270 bottom
R108  68.45,36.45 270 bottom
R109  32.89,47.62 90 bottom
R110  45.97,47.5 90 bottom
R111  68.2,47.37 0 bottom
R112  57.91,47.37 180 bottom
R113  42.55,49.28 0 bottom
R114  36.7,49.28 180 bottom
R115  45.97,51.82 90 bottom
R116  32.89,51.82 90 bottom
R117  69.34,53.34 0 bottom
R118  55.24,53.47 0 bottom
SCLK  81.92,43.05 0 top
SOUT  76.33,34.54 0 top
U1  49.4,34.04 270 top
XLAT  93.98,49.4 0 top

### Tracks (layer width: path | path; a pad name or v marks a point on that pad's centre or on a via)
+3V3  (via drill 0.4)
  Top 0.305: v54.36,54.86 v68.45,54.86 78.11,54.86 ARDUINO_NANO_V1.2
  Bottom 0.305: Q101.1 54.3,51.55 R118.2 54.36,53.53 v54.36,54.86 | 68.39,54.8 v68.45,54.86 68.45,53.4 R117.2 Q100.1
+5V  (via drill 0.35, 0.4)
  Top 0.305: R31.2 39.09,37.75 | 39.09,37.75 39.24,37.91 | R40.2 25.11,45.31 | U1.26 54.61,36.96 54.99,37.34 v56.39,37.34 | 8.96,46.86 R41.1 8,47.12 7.62,46.74 R38.2 6.29,44.77 5.21,45.85 5.21,50.93 5.95,51.67 17.76,51.67 | 38.99,37.85 39.09,37.75 | R37.2 52.31,42.55
  Top 0.406: 52.31,44.94 59.93,44.94 61.09,46.1 v61.09,46.99
  Top 0.508: R40.2 25.27,44.64 25.27,42.93
  Top 0.61: R31.2 37.27,37.65 36.7,37.08 R29.2 R28.2 33.4,36.38 R20.2 R19.2 28.96,35.37 R18.2 R17.2 25.97,34.54 v19.3,34.54 19.36,34.6 | R36.2 25.27,42.93 | 25.27,45.15 25.11,45.31 | J18.1 21.84,57.91 | J18.1 21.84,59.18 22.86,60.2 34.67,60.2 | 71.88,60.2 60.83,60.2 | 60.83,60.2 34.67,60.2 | J23.1 71.88,60.2 | J22.1 60.83,60.2 | 34.67,60.2 J19.1 39.62,52.58 v39.62,49.28 39.62,48.01 40.77,46.86 40.77,44.96 | R47.2 76.39,60.65 75.95,60.2 71.88,60.2 | IC1.8 17.71,42.12 C3.2 17.76,51.67 21.84,55.75 J18.1 | 52.3,40.38 C2.1 52.31,40.89 52.31,42.55 52.31,44.94 52.32,44.96 40.77,44.96 | U1.28 52.56,38.73 52.56,39.88 52.56,40.14 | R31.2 39.37,37.65 | R40.2 40.77,44.96 | R31.2 R32.2 40.77,44.96
  Top 0.813: v56.39,37.34 v57.53,37.34 57.02,37.34 57.02,38.48 55.12,40.39 53.34,40.39 C2.1
  Top 1.016: R44.2 110.75,48.77 112.9,46.61 ARDUINO_NANO_V1.12 112.9,37.59 R27.3 R26.3 R25.3 R24.3 R23.3 R22.3 R21.3 v76.45,37.34 | v56.39,37.34 56.39,38.35 54.86,39.88 52.56,39.88 | v57.53,37.34 57.53,38.73 55.37,40.89 52.31,40.89 | C2.1 52.56,40.14 52.56,38.73 53.34,39.52 53.34,40.39
  Bottom 0.305: 20.32,13.72 20.32,14.33 IC101.14 | 67.08,14.35 IC100.14 | D102.C 37.95,49.58 R114.2 | 41.4,52.47 D103.C 41.17,49.3 41.15,49.28 | v39.62,49.28 R113.2
  Bottom 0.406: R113.2 41.15,49.28 R114.2 | R112.2 59.24,46.99 v61.09,46.99 66.87,46.99 R111.2
  Bottom 0.61: C100.2 107.23,14.58 IC102.14 109.86,12.19 108.08,10.41 67.31,10.41 | C101.2 64.64,15.37 65.56,14.45 IC100.14 67.18,10.54 67.31,10.41 | v19.3,34.54 18.16,33.4 18.16,14.48 | 18.16,14.48 18.16,12.7 20.45,10.41 67.31,10.41 | C102.2 18.16,14.48 | IC101.14 20.17,14.48 18.16,14.48
  Bottom 0.813: R102.1 R101.1 56.23,34.19 | v56.39,37.34 57.02,37.34 | 57.02,37.34 v57.53,37.34 | 57.02,34.99 57.02,35.43 57.02,37.34
  Bottom 1.016: 57.15,34.99 R103.1 59.05,35.75 | 57.15,34.99 57.02,34.99 56.39,34.35 | 59.05,35.75 R105.1 R104.1 63.88,36.26 R106.1 67.06,37.4 R108.1 R107.1 71.05,37.34 v76.45,37.34 | 57.15,34.99 56.39,35.75 | 56.39,35.75 v56.39,37.34 | 57.34,35.75 57.53,35.94 v57.53,37.34 | 56.39,35.75 56.39,34.35 | 56.39,34.35 56.23,34.19 | 57.02,35.43 57.34,35.75 | 57.34,35.75 59.05,35.75
+12V  (via drill 0.4)
  Top 0.305: v112.39,2.54 v114.17,2.54 113.28,2.54 v113.28,4.06 | v120.02,2.54 v121.79,2.54 121.92,2.67 | 127.25,9.02 v127,10.92 | v104.78,2.54 v106.55,2.54 105.79,2.54 v105.79,3.94 | v97.16,2.54 v98.81,2.54 98.04,2.54 v98.04,3.94 | v91.44,2.54 90.42,2.54 | 90.42,2.54 v89.53,2.54 | v83.69,2.54 82.8,2.54 | 82.8,2.54 v81.92,2.54 | v75.95,2.54 75.06,2.54 | 75.06,2.54 v74.3,2.54 | v68.45,2.54 v66.67,2.54 | v51.44,2.54 v53.21,2.54 52.45,2.54 v52.45,4.06 | v43.81,2.54 v45.59,2.54 44.83,2.54 v44.83,3.94 | v12.57,2.54 v15.11,2.54 13.97,2.54 v13.97,3.81 | 127.25,7.62 126.36,8.51 | 127.25,7.62 127.25,6.1 | 127.25,7.62 126.82,7.62 J16.2 124.84,6.91 124.84,3.43 | 126.94,3.87 127.25,3.94 | 125.54,2.73 125.98,3.17 | 126.36,3.56 126.68,3.87 126.94,3.87 | 126.87,3.81 126.94,3.87 | v127,10.92 127.64,9.4 v128.27,9.78 126.87,8.26 v126.87,9.02 127.89,6.86 v128.27,8 127,5.84 v127,3.56 | v127,10.92 127.25,10.79 v128.27,11.81 128.27,12.19 127.51,12.95 | v127,3.56 126.17,2.73 125.54,2.73 | v125.35,2.54 125.48,2.67 125.86,2.67 | 124.71,3.3 125.48,4.06 | 125.54,2.73 v125.35,2.54 | 125.98,3.17 126.36,3.56 | 126.36,3.56 v127,3.56 | 121.92,2.67 124.84,2.67 124.84,3.43 | 124.84,3.43 127.51,6.1 | 125.98,3.17 124.59,3.81 | v36.96,3.81 36.96,2.54 38.1,2.54 38.1,2.29 v36.2,2.29 | v29.46,3.94 28.57,3.94 v28.57,2.41 | v21.97,3.81 21.97,2.54 v22.73,2.54 | v60.2,3.94 60.2,2.54 v60.96,2.54 | v67.69,3.94 67.69,2.6 68.54,2.6 | v75.06,3.94 75.06,2.54 | v82.8,3.94 82.8,2.54 | v90.42,4.06 90.42,2.54 | v120.9,3.94 120.9,2.67 121.92,2.67 | v125.48,4.32 125.48,2.54 v125.35,2.54
  Top 0.406: v83.69,2.54 87.25,2.54 87.5,2.79 | v75.95,2.54 79.12,2.41 79.5,2.79 | v91.44,2.54 94.87,2.54 95.12,2.79 | v98.81,2.54 99.06,2.79 102.74,2.79 | v106.55,2.54 106.81,2.79 110.36,2.79 | v114.17,2.54 114.43,2.79 117.98,2.79 | v68.45,2.54 68.54,2.6 68.83,2.79 71.88,2.79 | v60.96,2.54 61.21,2.79 64.26,2.79 | v45.59,2.54 45.85,2.79 48.9,2.79 | v53.21,2.54 53.47,2.79 56.52,2.79 | v37.97,2.54 38.1,2.54 41.27,2.54 41.53,2.79 | v30.35,2.54 33.4,2.54 33.66,2.79 | v22.73,2.54 25.78,2.54 26.04,2.79 | v12.57,2.54 12.32,2.79 | 126.87,10.29 v128.27,11.81 | 126.87,9.91 127.25,9.02 126.87,7.75
  Top 2.54: 125.86,2.67 124.84,2.67 | 125.29,3.48 J16.2 | 117.98,2.79 117.67,3.1 J15.2 | 110.36,2.79 110.05,3.1 J14.2 | 102.74,2.79 102.43,3.1 J13.2 | 95.12,2.79 94.81,3.1 J12.2 | J11.2 87.19,3.1 87.5,2.79 | J10.2 79.57,2.87 79.5,2.79 | J9.2 71.95,2.87 71.88,2.79 | J8.2 64.33,2.87 64.26,2.79 | J7.2 56.71,2.99 56.52,2.79 | J6.2 49.09,2.99 48.9,2.79 | J5.2 41.47,2.85 41.53,2.79 | J4.2 33.85,2.99 33.66,2.79 | J3.2 26.23,2.99 26.04,2.79 | J2.2 18.61,2.85 18.67,2.79 | J1.2 10.99,4.12 12.32,2.79 | 124.59,3.81 124.97,3.81
  Top 3.175: 125.48,4.06 127.51,6.1 | 127.51,12.95 127.51,6.1 | 127.51,6.1 127.51,4.7 125.98,3.17
  Top 3.81: 10.99,4.12 11.81,3.3 124.71,3.3
  Bottom 0.305: v120.02,2.54 118.11,2.54 117.78,2.87 117.67,2.87 | 125.73,3.56 124.97,3.56 | v112.39,2.54 v106.55,2.54 | v104.78,2.54 v98.81,2.54 | v97.16,2.54 v91.44,2.54 | v89.53,2.54 v83.69,2.54 | v81.92,2.54 v75.95,2.54 | v74.3,2.54 v68.45,2.54 | v66.67,2.54 v60.96,2.54 v59.05,2.54 v53.21,2.54 v45.59,2.54 | v37.97,2.54 v43.81,2.54 | v30.35,2.54 28.7,2.54 v28.57,2.41 22.86,2.41 v22.73,2.54 v20.95,2.54 | v20.95,2.54 v15.11,2.54 | v20.95,2.54 18.61,4.88 J2.2 | v128.27,11.81 128.27,12.31 R100.2 | v125.35,2.54 125.73,2.92 125.73,3.56 | v125.35,2.54 126.24,3.43 126.49,3.43 | v128.27,8 127.89,7.62 | 127.89,7.62 127.13,7.62 | v128.27,9.78 128.27,6.86 127.25,5.84 | 127.25,5.84 127.13,5.71 | 127.13,6.86 127.13,7.62 | 127.13,5.71 127.13,6.86 | 127.13,6.86 127.89,7.62 | 127.13,7.62 125.55,7.62 J16.2 125.29,3.88 125.29,3.81 | 125.29,3.81 125.29,2.72 | 125.29,2.72 125.35,2.67 | 125.48,3.3 126.75,3.3 v127,3.56 125.73,3.56 | 125.35,2.67 125.35,3.17 125.22,3.3 | 125.22,3.3 124.97,3.56 | 124.71,3.3 125.22,3.3 | 125.35,2.67 v125.35,2.54 | 124.71,3.3 123.95,2.54 v121.79,2.54 | 124.97,3.56 125.22,3.81 | 125.22,3.81 125.29,3.81 | 124.71,3.3 124.97,3.56 | 124.71,3.3 125.29,2.72 | 126.87,5.46 127.13,5.71 | 125.22,3.81 126.87,5.46 | 126.87,5.46 127.64,5.46 127.25,5.84 | 124.46,3.81 124.71,3.56 124.71,3.3 | 125.22,3.3 125.48,3.3 | 125.48,3.3 125.73,3.56
  Bottom 2.54: 125.22,6.17 J16.2 125.29,4.52 | 12.45,2.79 10.99,4.25 J1.2 | 126.49,3.43 125.73,2.67 125.6,2.79 | J2.2 18.61,2.87 18.54,2.79 | J3.2 26.23,2.85 26.29,2.79 | J4.2 33.85,2.85 33.91,2.79 | J5.2 41.47,2.85 41.53,2.79 | J6.2 49.09,2.87 49.02,2.79 | J7.2 56.71,2.98 56.9,2.79 | J8.2 64.33,2.87 64.26,2.79 | J9.2 71.95,2.98 72.14,2.79 | J10.2 79.57,2.85 79.63,2.79 | J11.2 87.19,2.99 87,2.79 | J12.2 94.81,2.85 94.87,2.79 | J13.2 102.43,2.87 102.36,2.79 | J14.2 110.05,2.87 109.98,2.79 | J15.2 117.67,2.87 117.6,2.79
  Bottom 3.81: 10.99,4.25 11.94,3.3 124.71,3.3 | 124.97,3.56 125.29,3.88 127.13,5.71 | 127.13,7.62 127.13,12.7
BLANK  (via drill 0.35, 0.4)
  Top 0.305: U1.2 45.45,37.61 44.58,38.48 44.58,42.04 v45.09,42.55 R37.1 | 89.66,57.53 BLANK.TP 90.04,57.53 | ARDUINO_NANO_V1.28 90.04,57.53 | v88.65,48.13 89.41,48.13 90.04,48.77 90.04,57.53
  Bottom 0.305: v88.65,48.13 79.25,48.13 73.66,42.55 v45.09,42.55
GND  (via drill 0.4)
  Top 0.305: 48.09,34.63 v48.51,34.8 | U1.6 48.3,35.01 v48.51,34.8 | U1.EXP v49.4,35.69 | 49.4,31.37 48.39,30.35 48.39,31.37 v48.51,31.5 | 49.4,31.37 49.4,30.35 48.26,29.21 | 49.28,34.04 v48.51,33.27 | 49.28,35.31 v50.29,36.58 | U1.EXP 49.28,35.31 | 49.28,35.31 v48.51,36.58 | U1.EXP 49.28,34.04 | 49.28,34.04 v48.51,34.8 | U1.EXP 49.4,31.37 | U1.EXP v49.4,32.38 v50.29,31.5 | 27.94,22.35 27.43,22.86 27.43,23.75 28.07,23.75
  Top 0.406: 28.07,23.88 v27.94,26.92 | Q9.3 66.04,21.97 | U1.1 46.5,38.43 46.52,38.42 46.86,38.76 | 46.86,38.76 46.86,38.86 45.72,38.86 46.15,38.43 U1.1 | U1.EXP 49.4,37.97 49.4,38.86 | 48.39,38.86 47.88,38.86 | 49.4,38.86 50.8,38.86 | 49.4,38.86 48.39,38.86 | 48.39,38.86 48.01,38.48 47.72,38.76 46.86,38.76 | U1.1 48.69,38.43 48.77,38.35 48.64,38.23 v50.29,36.58
  Top 0.61: Q16.3 119.51,25.08 R16.1 | 111.89,23.24 111.89,25.08 R15.1 | Q12.3 89.03,25.08 R12.1 90.36,29.27 90.3,29.34 | R15.1 arc90 113.41,26.6 | R16.1 120.84,27.75 | 105.54,29.34 97.79,29.34 | 97.79,29.34 90.3,29.34 | 90.3,29.34 82.8,29.34 | 82.8,29.34 75.95,29.34 75.06,28.45 75.12,28.38 R10.1 | 105.54,29.34 113.28,29.34 113.22,29.28 113.22,28.96 | R16.1 120.9,26.48 120.9,29.34 | R15.1 113.22,28.96 | 105.54,29.34 105.6,29.27 R14.1 104.27,25.08 104.27,22.48 103.63,21.84 | 97.79,29.34 97.98,29.14 R13.1 96.65,25.08 96.65,22.73 95.89,21.97 95.89,23.88 97.28,23.88 97.28,21.84 95.89,21.84 Q13.3 | 82.8,29.34 82.74,29.28 R11.1 81.41,25.08 81.41,22.73 80.64,21.97 80.64,24 81.92,24 82.17,23.75 82.17,21.84 80.64,21.84 Q11.3 | 5.21,22.86 Q1.3 4.57,21.97 | 5.21,22.86 5.21,25.08 R1.1 | R3.2 20.45,25.08 20.45,22.73 19.68,21.97 19.68,23.88 21.08,23.88 21.21,23.75 21.21,21.97 21.08,21.84 19.68,21.84 Q3.3 | 28.07,23.88 28.07,23.75 28.07,22.35 27.94,22.35 | 28.07,23.88 28.07,25.08 R4.2 29.4,28.13 29.34,28.19 | 43.31,23.11 43.31,25.08 R6.2 44.64,28.01 44.83,28.19 | 49.4,28.19 48.13,28.19 arc90 48.26,28.32 48.26,29.21 48.26,29.59 arc90 48.39,29.72 48.39,30.35 arc90 49.4,31.37 v49.4,32.38 | 67.31,28.19 67.5,28 R9.2 66.17,25.08 66.17,23.24 65.91,23.24 65.66,23.5 65.53,23.37 65.53,22.1 65.41,21.97 65.28,22.1 65.28,23.88 66.93,23.88 66.93,21.97 67.06,21.84 65.41,21.84 | 59.82,28.19 59.88,28.13 R8.2 58.55,25.08 58.55,23.11 58.04,23.62 57.91,23.62 57.91,22.1 57.78,21.97 57.66,22.1 57.66,24 59.18,24 59.31,23.88 59.31,21.84 57.78,21.84 | 52.2,28.19 52.26,28.13 R7.2 50.93,25.08 50.93,22.48 50.16,21.72
  Top 0.61: 37.08,28.19 37.02,28.13 R5.2 35.69,25.08 Q5.3 34.92,21.84 | v14.35,28.96 12.76,25.15 12.83,25.08 Q2.3 12.06,21.84 | 48.13,40.26 arc-90 48.01,40.39 | 49.4,28.19 arc-90 48.77,28.83 | 48.77,28.83 48.77,29.59 49.4,30.23 49.4,29.46 arc-90 48.77,28.83 | 48.77,28.83 arc90 49.4,28.19 | 49.4,28.19 49.66,28.19 | 49.66,28.19 50.16,28.19 50.16,28.7 | 50.16,28.7 50.16,33.27 arc90 U1.EXP arc-90 49.66,33.78 49.66,28.19 | 48.77,28.83 arc-90 49.4,28.19 | 50.67,28.19 50.67,29.21 arc90 50.16,28.7 | R33.1 29.72,37.85 v29.97,37.59 | 113.22,28.96 113.6,29.34 120.9,29.34 | 120.9,29.34 121.28,29.34 | 4.57,21.97 4.57,21.84 5.71,21.84 5.84,21.97 5.84,23.88 4.45,23.88 | 12.06,21.84 13.46,21.84 13.46,23.75 11.94,23.75 12.06,23.62 12.06,21.84 | 4.57,21.97 4.57,23.37 5.08,22.86 5.21,22.86 | Q4.3 28.07,22.48 27.94,22.35 | 27.94,22.35 27.3,21.72 28.83,21.72 28.83,23.88 28.07,23.88 | 27.3,21.97 27.69,22.35 27.94,22.35 | 34.92,21.84 34.92,21.72 36.45,21.72 36.45,23.88 34.92,23.88 34.92,21.84 | Q6.3 42.55,21.84 42.55,21.72 43.94,21.72 43.94,23.88 42.42,23.88 42.42,22.23 | 42.42,21.72 42.42,22.23 | 42.42,22.23 42.8,22.61 42.8,23.62 43.31,23.11 | 43.31,23.11 43.31,22.99 | Q7.3 50.16,21.84 | 50.16,21.84 50.16,21.72 | 50.16,21.72 51.69,21.72 51.69,23.75 51.56,23.88 50.16,23.88 50.16,21.84 | Q8.3 57.78,21.84 | 57.78,21.84 57.66,21.84 | Q9.3 65.41,21.84 | 65.41,21.84 65.28,21.84 | Q10.3 73.03,21.84 74.42,21.84 74.55,21.97 74.42,22.1 74.42,23.75 74.3,23.88 73.15,23.88 73.15,22.1 | 73.15,22.1 73.03,21.97 | 73.15,22.1 73.79,22.73 73.79,26.42 | Q12.3 88.27,21.84 | 88.27,21.84 88.14,21.84 | 88.27,21.84 89.79,21.84 89.79,23.88 88.14,23.88 88.14,21.97 88.77,22.61 Q12.3
  Top 0.61: Q14.3 103.5,21.84 103.63,21.84 | 103.63,21.84 105.03,21.84 105.03,23.88 104.9,24 103.5,24 103.5,21.97 103.63,21.84 | Q15.3 111.12,21.84 | 111.12,21.84 111.12,21.72 112.65,21.72 112.78,21.84 112.65,21.97 112.65,23.88 111.12,23.88 111.12,21.84 | Q16.3 118.75,21.84 118.75,21.72 120.27,21.72 120.27,23.88 120.14,24 118.75,24 118.75,21.97 118.87,21.97 Q16.3
  Top 0.813: Q13.3 96.65,22.48 | Q14.3 104.27,21.21 | Q15.3 111.89,21.21 | Q10.3 73.79,22.99 | 66.17,23.11 66.17,23.24 | 35.69,21.84 Q5.3 | 28.07,22.48 28.07,22.35
  Top 1.016: J17.2 125.52,36.58 124.33,36.58 | J17.2 125.6,37.85 | J17.2 125.68,36.58 126.87,36.58 | J17.2 125.6,35.31 | R27.1 R26.1 R25.1 R24.1 R23.1 R22.1 R21.1 | 117.98,42.55 ARDUINO_NANO_V1.14 117.98,47.62 | 112.9,61.59 ARDUINO_NANO_V1.19 112.9,59.05 | 48.01,40.39 C2.2 | 48.39,38.86 48.39,39.73 C2.2 | C2.2 49.04,38.34 49.4,37.97 | 70.61,28.19 50.67,28.19 | 48.13,28.19 29.34,28.19
  Bottom 0.305: 48.51,30.73 50.29,30.73 | 49.4,30.23 v49.4,32.38 U1.EXP v49.4,35.69 49.4,37.47 | v48.51,31.5 v50.29,31.5 | v48.51,34.8 v50.29,34.8 | 48.39,37.97 50.42,37.97 | C104.1 50.66,49.4 | 50.66,49.4 50.65,49.53 | 50.66,49.4 50.91,49.65 D101.A 50.91,54.21 53.83,57.13 J22.3 | C103.1 27.96,47.24 D100.A 27.56,50.57 R46.1
  Bottom 0.406: IC101.7 27.81,24.26 v27.94,26.92 | C101.1 64.64,20.7 | C100.1 111.12,17.26 | 111.12,17.26 113.54,17.26 | 113.54,17.26 115.43,17.26 117.47,19.3 IC102.7 | IC102.13 111.12,17.26 | IC102.11 113.67,17.13 113.54,17.26
  Bottom 0.61: 11.81,28.19 13.59,28.19 13.59,31.11 20.32,37.85 29.72,37.85 v29.97,37.59 | 11.81,28.19 9.91,28.19 | 11.81,28.19 v14.35,28.96 11.81,16.38 13.72,14.48 C102.1 | 53.85,60.2 64.64,60.2 64.9,60.2 64.88,60.18 J23.3 | 53.85,60.2 46.1,60.2 | 46.1,60.2 40.26,60.2 38.66,58.6 J20.2 | J21.2 46.28,60.02 46.1,60.2 | J22.3 53.83,60.18 53.85,60.2 | IC100.7 74.8,23.88 v73.66,25.02 71.25,27.43 v65.15,27.18
  Bottom 0.813: 64.64,60.2 76.12,60.2 76.33,59.99
  Bottom 1.016: 76.33,59.99 76.07,59.74 | J17.2 122.86,36.5 121.92,36.32 | J17.2 125.6,39.12 | J17.2 125.68,36.58 126.87,36.58 | J17.2 125.6,35.31 | 117.98,47.62 ARDUINO_NANO_V1.14 117.98,42.55 | 112.9,59.05 ARDUINO_NANO_V1.19 112.9,61.59
  other vias: 13.08,27.69 7.24,49.28 9.65,58.55 52.2,47.12 19.43,49.15 41.66,54.61 15.88,45.72 49.4,34.04 52.96,22.1 14.86,23.24 14.86,22.1 7.11,23.11 7.11,21.97 27.69,43.43 13.08,28.96 14.35,27.69 6.73,30.23 8.38,58.55 9.65,57.28 8.38,57.28 19.68,43.43 53.47,47.12 42.93,54.61 105.79,22.1 121.79,23.37 84.45,43.05 98.17,22.1 37.59,23.11 37.59,21.97 45.09,23.24 45.09,22.1 52.96,23.24 98.17,23.37 105.79,23.37 121.79,22.35 78.23,41.66 50.29,33.27 27.94,28.07
  pour Top (isolate 0.711): 0,65.02 130.05,65.02 130.05,2.54 0,2.54
  pour Bottom (isolate 0.711): 0,65.02 130.05,65.02 130.05,13.97 0,13.97
GSCLK
  Top 0.305: 96.39,47.88 96.39,40.39 94.74,38.73 69.72,38.73 68.07,37.08 61.09,37.08 60.31,36.31 U1.25 | 96.39,47.88 96.39,57.02 98.17,58.8 106.93,58.8 107.82,59.69 ARDUINO_NANO_V1.21 | GSCLK.TP 96.39,47.88
LIGHT_SENSOR1  (via drill 0.4)
  Top 0.305: v14.99,39.75 IC1.1 12.13,39.75 R39.1 13.34,42.55 13.84,43.05 LED1.A 13.62,47.12 R41.2
  Bottom 0.305: ARDUINO_NANO_V1.20 110.36,58.67 106.05,54.36 95.38,54.36 90.17,49.15 78.87,49.15 73.03,43.31 32.13,43.31 28.57,39.75 v14.99,39.75
LIGHT_SENSOR2  (via drill 0.4)
  Top 0.305: 23.05,44.58 23.05,42.93 R35.1 21.14,42.61 20.45,41.91 v20.45,41.15 20.45,39.37 19.56,38.48 IC1.7 | 23.05,44.58 R40.1 | LED2.A 23.71,47.08 22.99,46.35 22.99,44.64 23.05,44.58
  Bottom 0.305: ARDUINO_NANO_V1.22 105.28,58.8 101.73,55.24 94.87,55.24 89.66,50.04 78.36,50.04 72.39,44.07 33.02,44.07 32.64,44.07 31.5,44.07 28.57,41.15 v20.45,41.15
N$1  (via drill 0.4)
  Top 0.305: 40.89,35.63 R32.1 40.77,35.05 v41.27,34.54 41.46,34.36 U1.7
  Bottom 0.305: IC101.1 20.19,32.64 23.5,35.94 39.88,35.94 v41.27,34.54
N$2  (via drill 0.4)
  Top 0.305: U1.8 39.7,33.71 v38.99,34.42 38.73,34.67 R31.1
  Bottom 0.305: IC101.3 22.73,31.62 26.16,35.05 38.35,35.05 v38.99,34.42
N$3  (via drill 0.4)
  Top 0.305: U1.9 36.92,33.06 v36.7,33.27 R29.1
  Bottom 0.305: IC101.5 25.27,29.21 30.23,34.16 35.81,34.16 v36.7,33.27
N$4  (via drill 0.4)
  Top 0.305: U1.10 35.28,32.41 v34.54,33.15 R28.1
  Bottom 0.305: IC101.9 26.54,12.95 26.8,12.7 28.7,12.7 34.54,18.54 v34.54,33.15 34.42,33.02
N$5  (via drill 0.4)
  Top 0.305: U1.11 32.76,31.76 v32.38,32.13 R20.1
  Bottom 0.305: IC101.11 24,15.75 24.64,16.38 28.19,16.38 31.37,19.56 31.37,25.78 32.38,26.8 v32.38,32.13
N$6  (via drill 0.4)
  Top 0.305: U1.12 30.86,31.11 30.35,31.62 v30.35,32.13 R19.1
  Bottom 0.305: IC101.13 21.46,16.26 22.73,17.53 27.81,17.53 30.35,20.07 v30.35,32.13
N$7  (via drill 0.4)
  Top 0.305: U1.13 42.02,30.46 v41.91,30.35 29.84,30.35 28.19,32 R18.1
  Bottom 0.305: 67.16,20.57 IC100.1 67.18,21.84 66.93,22.1 56.26,22.1 51.31,27.05 44.07,27.05 41.91,29.21 v41.91,30.35
N$8  (via drill 0.4)
  Top 0.305: 43.61,29.77 v43.56,29.72 | U1.14 43.64,29.64 v43.56,29.72 | 26.04,32.38 R17.1 26.04,31.88 26.42,31.5 27.18,31.5 29.08,29.59 43.43,29.59 v43.56,29.72
  Bottom 0.305: IC100.3 69.72,22.23 68.33,23.62 58.42,23.62 54.1,27.94 44.7,27.94 43.56,29.08 v43.56,29.72
N$9  (via drill 0.4)
  Top 0.305: v72.9,35.18 61.98,35.18 61.16,34.36 U1.22
  Bottom 0.305: IC102.9 116.2,16.26 119,19.05 119,25.4 115.19,29.21 78.87,29.21 v72.9,35.18 71.44,35.18 R107.2
N$10  (via drill 0.4)
  Top 0.305: 8.44,25.47 R1.2 | R1.2 9.4,25.15 9.91,24.64 9.91,22.73 Q1.1 | R1.2 9.27,25.15 | R1.2 8.44,26.86 13.65,32.07 13.84,32.26 14.48,32.89 20.95,32.89 v21.46,32.38
  Bottom 0.305: IC101.2 v21.46,32.38
N$11  (via drill 0.4)
  Top 0.305: U1.20 65.87,33.06 v65.91,33.02
  Bottom 0.305: IC102.3 112.39,22.48 107.5,27.37 77.53,27.37 71.88,33.02 v65.91,33.02 R106.2
N$12  (via drill 0.4)
  Top 0.305: U1.19 63.22,32.41 v63.88,31.75
  Bottom 0.305: IC102.1 109.86,22.35 106.81,25.4 80.9,25.4 79.88,26.42 77.22,26.42 71.88,31.75 v63.88,31.75 63.37,32.26 R104.2
N$13  (via drill 0.4)
  Top 0.305: v57.15,31.11 56.5,31.76 U1.18
  Bottom 0.305: IC100.13 68.45,16.26 70.36,18.16 75.31,18.16 75.95,18.8 75.95,24.13 71.37,28.7 59.56,28.7 v57.15,31.11 56.45,31.82 R101.2 | R101.2 56.07,31.5 | R101.2 55.75,31.37
N$14  (via drill 0.4)
  Top 0.305: U1.17 54.61,31.11 | 54.61,31.11 | 54.61,31.11 55.56,30.16 57.59,30.16 v58.93,31.5
  Bottom 0.305: IC100.11 70.99,16 71.37,16.38 76.58,16.38 77.34,17.14 77.34,24 71.75,29.59 60.83,29.59 v58.93,31.5 58.29,32.13 R103.2
N$15  (via drill 0.4)
  Top 0.305: U1.16 54.12,30.46 55.12,29.46 58.8,29.46 v60.83,31.5
  Bottom 0.305: IC100.9 73.53,13.08 73.91,12.7 75.95,12.7 80.26,17.02 80.26,24.51 78.99,25.78 76.71,25.78 72.01,30.48 61.85,30.48 v60.83,31.5 R105.2
N$16  (via drill 0.4)
  Top 0.305: U1.15 53.67,29.64 v53.72,29.59
  Bottom 0.305: IC100.5 72.26,23.5 70.1,25.65 57.53,25.65 53.72,29.46 v53.72,29.59 53.21,30.1 R102.2
N$17  (via drill 0.4)
  Top 0.305: U1.21 61.65,33.71 62.1,34.16 v68.45,34.16
  Bottom 0.305: IC102.5 114.94,23.88 110.49,28.32 78.36,28.19 72.39,34.16 v68.45,34.16 R108.2
N$18
  Top 2.54: Q2.2 J2.1
N$19  (via drill 0.4)
  Top 0.305: Q3.1 25.02,24.13 25.02,24.77 25.02,25.15 | v26.54,24.38 25.78,25.15 25.02,25.15 | 25.02,25.15 R3.1
  Bottom 0.305: IC101.6 v26.54,24.38
N$20
  Top 2.54: 31.31,14.03 Q4.2 J4.1
N$21  (via drill 0.4)
  Top 0.305: Q8.1 63.12,24.77 63.25,24.64 v63.12,24.64 63.12,25.27 62.87,25.53 62.16,25.53 R8.1
  Bottom 0.305: IC100.4 70.99,23.37 69.72,24.64 v63.12,24.64 64.64,24.64
N$22
  Top 2.54: 23.69,14.03 Q3.2 J3.1
N$23  (via drill 0.4)
  Top 0.305: Q4.1 v32.64,24.77 32.64,25.02 32.38,25.27 31.43,25.27 R4.1
  Bottom 0.305: 32.64,22.23 v32.64,24.77 32.64,19.28 IC101.8
N$24  (via drill 0.4)
  Top 0.305: Q16.1 v124.08,24.64 124.08,24.89 123.83,25.15 R16.2
  Bottom 0.305: IC102.8 124.08,21.18 v124.08,24.64
N$25
  Top 2.54: 122.75,14.03 Q16.2 J16.1
N$26
  Top 2.54: 7.49,17.53 Q1.2 J1.1
N$27  (via drill 0.4)
  Top 0.305: v40.26,24.77 40.26,25.15 40.01,25.4 39.18,25.4 R5.1
  Top 0.406: Q5.1 v40.26,24.77
  Bottom 0.305: v40.26,24.77 40.26,19.94 32.38,12.06 26.16,12.06 25.27,12.95 IC101.10
N$28
  Top 2.54: 38.93,14.03 Q5.2 J5.1
N$29
  Top 2.54: 61.79,14.03 Q8.2 J8.1
N$30  (via drill 0.4)
  Top 0.305: Q6.1 v47.88,24.77 47.88,25.4 47.62,25.65 46.67,25.65 46.54,25.53 | 46.74,25.65 46.61,25.78 46.54,25.71 46.54,25.53 | 46.54,25.53 46.54,25.27 | 46.54,25.27 R6.1 | 46.67,25.4 46.54,25.27
  Bottom 0.305: IC101.12 22.73,13.21 24.51,11.43 38.48,11.43 47.88,20.83 v47.88,24.77
N$31
  Top 2.54: 77.03,14.03 Q10.2 J10.1
N$32
  Top 2.54: 46.55,14.03 Q6.2 J6.1
N$33  (via drill 0.4)
  Top 0.305: R15.2 115.95,25.15 v116.46,24.64 Q15.1
  Bottom 0.305: IC102.6 116.2,24.38 v116.46,24.64
N$34
  Top 2.54: 115.13,14.03 Q15.2 J15.1
N$35
  Top 0.305: U1.24 60.81,35.66 61.34,36.2 74.68,36.2 SOUT.TP
N$36  (via drill 0.4)
  Top 0.305: v110.36,26.42 108.08,26.42 107.5,25.84 R14.2 108.46,25.15 108.84,24.77 Q14.1
  Bottom 0.305: v110.36,26.42 113.67,23.11 IC102.4
N$37
  Top 2.54: 107.51,14.03 Q14.2 J14.1
N$38  (via drill 0.4)
  Top 0.305: Q10.1 v78.36,24.77 77.98,25.15 R10.2
  Bottom 0.305: 78.36,22.23 v78.36,24.77 78.36,16.89 75.69,14.22 75.03,14.22 IC100.8
N$39  (via drill 0.4)
  Top 0.305: 101.22,23.37 Q13.1 101.22,24.51 100.58,25.15 R13.2 99.88,25.97 100.33,26.42 v101.22,26.42
  Bottom 0.305: IC102.2 111.12,22.35 107.06,26.42 v101.22,26.42
N$40  (via drill 0.4)
  Top 0.305: v70.74,26.42 69.72,26.42 69.4,26.1 69.4,25.21 | 69.4,25.21 R9.1 | 70.87,22.73 Q9.1 70.74,24.77 70.36,25.15 69.47,25.15 69.4,25.21
  Bottom 0.305: IC100.6 73.53,23.75 70.87,26.42 v70.74,26.42
N$41
  Top 2.54: 99.89,14.03 Q13.2 J13.1
N$42
  Bottom 0.305: R116.2 35.5,55.37 39.5,55.37 41.66,57.53 J20.1
N$43  (via drill 0.4)
  Top 0.305: Q12.1 v93.6,24.51 93.6,25.15 93.34,25.4 92.52,25.4 R12.2
  Bottom 0.305: v93.6,24.51 93.6,21.59 83.44,11.43 71.12,11.43 69.72,12.83 IC100.12
N$44
  Top 2.54: 92.27,14.03 Q12.2 J12.1
N$45
  Top 2.54: 69.41,14.03 Q9.2 J9.1
N$46  (via drill 0.4)
  Top 0.305: Q11.1 v85.98,24.51 85.98,25.02 85.72,25.27 84.77,25.27 R11.2
  Bottom 0.305: v85.98,24.51 85.98,20.07 77.98,12.06 72.77,12.06 72.26,12.57 IC100.10
N$47
  Top 2.54: 84.65,14.03 Q11.2 J11.1
N$48
  Bottom 0.305: R115.2 45.97,53.72 J21.1
N$49
  Top 0.305: 7.75,42.74 R38.1 | R38.1 7.87,42.55 R39.2 | IC1.3 12.45,37.15 R30.2 R38.1
N$50  (via drill 0.4)
  Top 0.305: IC1.2 v9.91,38.48
  Bottom 0.305: J18.2 15.75,57.53 R45.2 11.3,53.09 7.49,53.09 4.95,50.55 4.95,43.43 v9.91,38.48
N$51
  Top 0.61: D1.C 116.75,36.59 C1.2
  Top 1.016: IC2.3 125.48,55.37 126.87,53.98 126.87,44.59 D1.C
N$52  (via drill 0.4)
  Top 0.305: v126.11,28.83 127.25,26.16 v128.14,29.46 v126.11,28.83 | v126.11,28.83 v126.11,26.42 127.25,27.05 v128.14,21.97 127,22.48 v126.11,24.51 | v126.11,28.83 126.87,22.86 | 126.87,22.86 v128.02,20.57 | v128.02,20.57 127.25,21.46 127.05,20.31 127,21.02 126.87,20.95 | 128.27,27.69 127.25,29.59 | v126.11,24.51 126.87,22.86 | 126.87,22.86 127.89,23.75 v128.02,20.57 | 128.02,23.75 126.87,23.75 v126.11,24.51
  Top 0.406: 126.77,20.95 126.87,20.95 127,20.95 v128.02,20.57 128.27,21.21 127.23,21.21 | v126.11,22.48 v126.49,20.57 127.25,22.73 v126.11,24.51
  Top 1.27: J17.1 119.87,31.5 D1.A
  Top 3.175: 127.23,29.86 127.25,29.84 127.25,29.59 127.25,27.05 127.25,26.16
  Top 3.81: J17.1 127.23,29.86 127.23,21.21
  Bottom 0.305: R100.1 127,19.18 127,20.45 v128.14,21.97
  Bottom 3.175: J17.1 127.25,29.84
  Bottom 3.81: J17.1 127.13,29.97 127.13,19.56
N$53  (via drill 0.4)
  Top 0.305: IC1.6 16.51,37.21 16.26,37.21 15.88,37.21 15.11,36.45 15.11,34.92 13.97,33.78 v12.95,33.78
  Bottom 0.305: J19.2 29.84,57.53 28.7,56.39 R46.2 25.27,56.39 23.5,54.61 23.5,50.55 12.95,40.01 v12.95,33.78
N$54
  Top 0.305: R35.2 R36.1 25.27,38.17 R33.2 21.46,37.85 19.56,35.94 IC1.5
N$55  (via drill 0.35, 0.4)
  Top 0.305: U1.27 53.36,37.61 v54.23,38.48 | v58.8,38.86 R34.2
  Bottom 0.305: v54.23,38.48 54.61,38.86 v58.8,38.86
N$56
  cutout Top: 0,43.81 4.57,43.81 4.57,25.27 0,25.27
N$57
  Bottom 0.305: R115.1 R110.2 | R115.1 45.25,50.87 | R115.1 44.77,50.87 43.67,51.96 D103.A | R115.1 47.44,50.87 48.41,51.84 D101.C
N$59
  Bottom 0.305: R109.2 R116.1 | R116.1 34.5,50.87 35.45,51.82 D102.A | R116.1 31.16,50.87 D100.C
N$62
  Top 0.305: ARDUINO_NANO_V1.30 R47.1 78.61,60.39 JP3.1
N$63
  Bottom 0.305: 57.4,57.91 57.33,57.98 J22.2 57.33,55.81 56.2,54.67 R118.1 | R118.1 56.2,51.55 Q101.2 | 57.28,53.47 60.07,53.47 61.09,52.45 JP1.1 | 57.28,53.47 R118.1 | 57.33,53.52 57.28,53.47
N$64
  Bottom 0.305: JP2.2 64.64,53.79 J23.2 70.29,55.62 R117.1 Q100.2
N$66
  Top 1.016: 115.57,54.1 115.57,53.12 | 115.57,53.12 IC2.4 | 115.45,51.56 115.7,51.82 115.57,51.94 115.57,53.12
  Top 1.27: C4.+ 109.22,53.59 | 109.22,53.59 115.06,53.59 115.57,54.1 | R44.1 109.47,53.34 109.22,53.59
N$67
  Top 0.305: 13.62,49.28 LED1.C 13.68,49.28 R43.1
N$69
  Top 0.305: R42.1 22.95,49.18 LED2.C
N$70  (via drill 0.4)
  Top 0.305: 16.06,25.21 R2.1 | R2.1 16.89,25.15 17.4,24.64 Q2.1 | R2.1 16.06,26.73 18.54,29.21 23.62,29.21 v24,28.83
  Bottom 0.305: IC101.4 v24,28.83
N$71  (via drill 0.4)
  Top 0.305: Q7.1 v55.5,24.89 55.5,25.4 55.24,25.65 54.1,25.65 54.16,25.59 R7.1
  Bottom 0.305: IC100.2 68.45,22.1 67.69,22.86 57.53,22.86 v55.5,24.89
N$73
  Top 2.54: 54.17,14.03 Q7.2 J7.1
REG1
  Bottom 0.305: ARDUINO_NANO_V1.5 90.3,40.64 86.87,40.64 81.41,35.18 R21.2
REG2
  Bottom 0.305: 97.54,45.34 ARDUINO_NANO_V1.6 87,34.8 R22.2
REG3
  Bottom 0.305: ARDUINO_NANO_V1.7 100.2,43.18 R23.2
REG4
  Bottom 0.305: ARDUINO_NANO_V1.8 102.74,40.51 R24.2
REG5
  Bottom 0.305: ARDUINO_NANO_V1.9 104.39,44.58 104.39,36.32 102.87,34.8 R25.2
REG6
  Bottom 0.305: ARDUINO_NANO_V1.10 105.92,43.56 105.92,36.32 R26.2
REG7
  Bottom 0.305: ARDUINO_NANO_V1.11 110.36,37.08 R27.2
SCLK  (via drill 0.35)
  Top 0.305: U1.4 44.46,36.31 42.67,38.1 v42.67,38.86
  Bottom 0.305: 81.92,45.47 79.38,45.47 74.8,40.89 46.99,40.89 46.61,40.89 44.7,40.89 v42.67,38.86 | 81.92,45.47 ARDUINO_NANO_V1.1 | SCLK.TP 81.92,45.47
SENSOR_BOTTOM
  Bottom 0.305: ARDUINO_NANO_V1.25 97.66,59.56 96.14,58.04 93.85,58.04 88.27,52.45 76.71,52.45 71.63,47.37 R111.1 69.34,47.56 Q100.3 64.66,49.29 JP2.1
SENSOR_TOP  (via drill 0.4)
  Top 0.305: JP1.2 62.61,47.75 69.22,47.75 v74.68,53.21
  Bottom 0.305: 55.39,49.4 Q101.3 55.37,47.62 55.63,47.37 R112.1 56.96,48.58 57.66,49.28 JP1.2 | v74.68,53.21 87.63,53.21 ARDUINO_NANO_V1.26
SIN  (via drill 0.35, 0.4)
  Top 0.305: v76.07,39.88 86.36,39.88 88.65,42.16 88.65,46.35 85.72,49.28 85.72,58.93 ARDUINO_NANO_V1.29 | U1.5 43.59,35.66 v43.05,36.2
  Bottom 0.305: v43.05,36.2 43.05,37.47 45.47,39.88 v76.07,39.88
SWITCH_BOTTOM
  Bottom 0.305: ARDUINO_NANO_V1.24 100.2,59.18 98.17,57.15 94.11,57.15 88.52,51.56 77.22,51.56 71.25,45.59 46.1,45.59 45.97,45.72 R110.1 | C104.2 48.66,47.9 47.31,46.55 R110.1 | R113.1 43.49,47.56 44.51,46.55 R110.1
SWITCH_TOP
  Bottom 0.305: ARDUINO_NANO_V1.23 102.74,59.05 99.82,56.13 94.36,56.13 89.03,50.8 77.72,50.8 71.75,44.83 33.85,44.83 32.89,45.79 R109.1 | C103.2 30.52,46.67 R109.1 | R114.1 35.75,47.95 34.48,46.67 R109.1
XLAT  (via drill 0.4)
  Top 0.305: U1.3 45.08,36.96 43.56,38.48 v43.56,41.27 | v91.19,47.12 92.08,47.12 92.58,47.62 92.58,49.28 | 92.58,49.28 ARDUINO_NANO_V1.27 | XLAT.TP 92.71,49.4 92.58,49.28
  Bottom 0.305: v91.19,47.12 79.5,47.12 74.17,41.78 44.07,41.78 v43.56,41.27

### Text on the board
Top: [przemo] 2018
tNames: LIGHT / SENSOR 1 | LIGHT / SENSOR 2 | TOP / SWITCH | BOTTOM / SWITCH | TOP SENSOR / GND | IN | +5V | BOTTOM SENSOR / GND | IN | +5V | GND | 1 | 2 | 3 | 4 | 5 | 6 | 7 | 12V | - 1 + | - 2 + | - 3 + | - 4 + | - 5 + | - 6 + | - 7 + | - 8 + | - 9 + | - 10 + | - 11 + | - 12 + | - 13 + | - 14 + | - 15 + | - 16 +